# Altium project DRIVER MOTION_A.PrjPcb (part 1 of 2)
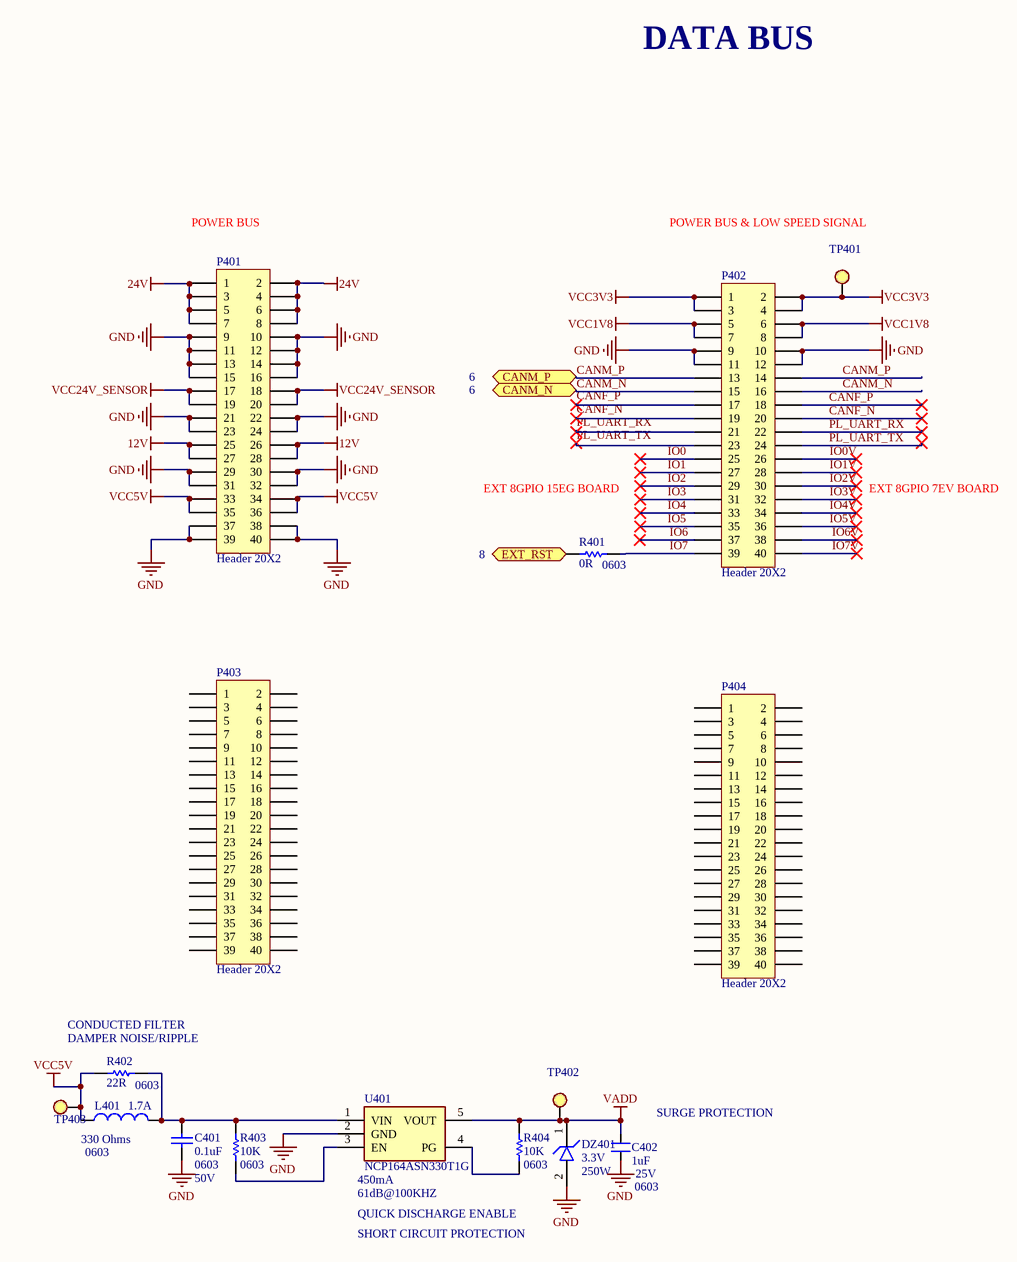
[diagram p0: [4]_MOT_POWER.SchDoc]
9 sheets, 302 parts. Net scope: flat (ports and power ports of the same name join across sheets).
Board file: DRIVER MOTION PAN.PcbDoc
Sheets:
  [4]_MOT_POWER.SchDoc
  [5]_MOT_MCU MKV58.SchDoc
  [6]_MOT_H-BDIGDE FOC.SchDoc
  [7]_MOT_CONTROL LED STATUS.SchDoc
  [8]_MOT_CONNECTOR.SchDoc
  [9]_MOT_tMCU MKV58.SchDoc
  [10]_MOT_tH-BDIGDE FOC.SchDoc
  [11]_MOT_tCONTROL LED STATUS.SchDoc
  [12]_MOT_tCONNECTOR.SchDoc

## Sheet [4]_MOT_POWER.SchDoc
size A3; DocumentNumber: 4; SheetNumber: 4; SheetTotal: 12; Ngu?i ki?m tra: bangdd; Ngu?i thi?t k?: thannt114

### Parts
C401  FOOTPRINT: 0603  Voltage: 50V  [CAP 0603]  (hidden comment: 0.1uF)
C402  PCB FOOTPRINT: 0603  Voltage: 25V  [CAP 0603]  (hidden comment: 1uF)
DZ401  Voltage - Reverse Standoff: 3.3V  Power - Peak Pulse: 250W  [SOD-323]  (hidden comment: ESD8351HT1G)
L401  PCB Footprint: 0603  Current: 1.7A  [FB 0603]  (hidden comment: 330 Ohms)
P401  Header 20X2  [SAMTEC_SSQ-120-03-G-D]
P402  Header 20X2  [SAMTEC_SSQ-120-03-G-D]
P403  Header 20X2  [SAMTEC_SSQ-120-03-G-D]
P404  Header 20X2  [SAMTEC_SSQ-120-03-G-D]
R401  PCB Footprint: 0603  [res 0603]  (hidden comment: 0R)  (no BOM)
R402  PCB Footprint: 0603  [res 0603]  (hidden comment: 22R)
R403  PCB Footprint: 0603  [res 0603]  (hidden comment: 10K)
R404  PCB Footprint: 0603  [res 0603]  (hidden comment: 10K)
TP401  TP SMD  [TESTPOINT]  (value not drawn)  (no BOM)
TP402  TP SMD  [TESTPOINT]  (value not drawn)  (no BOM)
TP403  TP SMD  [TESTPOINT]  (value not drawn)  (no BOM)
U401  NCP164ASN330T1G  CURRENT: 450mA  PSRR: 61dB@100KHZ  [SOT23-5]

### Ports
CANM_N (bidir, see 6), CANM_P (bidir, see 6), EXT_RST (bidir, see 8)

### Nets
12V: P401.25 P401.26 P401.27 P401.28
24V: P401.1 P401.2 P401.3 P401.4 P401.5 P401.6 P401.7 P401.8
GND: C401.1 C402.2 DZ401.2 P401.9 P401.10 P401.11 P401.12 P401.13 P401.14 P401.15 P401.16 P401.21 P401.22 P401.23 P401.24 P401.29 P401.30 P401.31 P401.32 P401.37 P401.38 P401.39 P401.40 P402.9 P402.10 P402.11 P402.12 U401.2(GND)
VADD: C402.1 DZ401.1 R404.1 TP402.1 U401.5(VOUT)
VCC1V8: P402.5 P402.6 P402.7 P402.8
VCC3V3: P402.1 P402.2 P402.3 P402.4 TP401.1
VCC5V: L401.1 P401.33 P401.34 P401.35 P401.36 R402.1 TP403.1
VCC24V_SENSOR: P401.17 P401.18 P401.19 P401.20
CANF_N: P402.19 P402.20
CANF_P: P402.17 P402.18
CANM_N: P402.15 P402.16 ; port CANM_N
CANM_P: P402.13 P402.14 ; port CANM_P
IO0: P402.25
IO0V: P402.26
IO1: P402.27
IO1V: P402.28
IO2: P402.29
IO2V: P402.30
IO3: P402.31
IO3V: P402.32
IO4: P402.33
IO4V: P402.34
IO5: P402.35
IO5V: P402.36
IO6: P402.37
IO6V: P402.38
IO7: P402.39 R401.2
IO7V: P402.40
PL_UART_RX: P402.21 P402.22
PL_UART_TX: P402.23 P402.24
NetC401_2: C401.2 L401.2 R402.2 R403.1 U401.1(VIN)
NetR401_1: R401.1 ; port EXT_RST
NetR403_2: R403.2 U401.3(EN)
NetR404_2: R404.2 U401.4(PG)

Not connected (* = marked no-connect by the designer): P403 1 2 3 4 5 6 7 8 9 10 11 12 13 14 15 16 17 18 19 20 21 22 23 24 25 26 27 28 29 30 31 32 33 34 35 36 37 38 39 40; P404 1 2 3 4 5 6 7 8 9 10 11 12 13 14 15 16 17 18 19 20 21 22 23 24 25 26 27 28 29 30 31 32 33 34 35 36 37 38 39 40

### Notes on the sheet
- DATA BUS
- (near P401) POWER BUS
- POWER BUS & LOW SPEED SIGNAL
- EXT 8GPIO 15EG BOARD
- EXT 8GPIO 7EV BOARD
- (near R402) CONDUCTED FILTER
- (near R402) DAMPER NOISE/RIPPLE
- (near C402) SURGE PROTECTION
- QUICK DISCHARGE ENABLE
- SHORT CIRCUIT PROTECTION

### Library data of the parts
C401 = Cap: CAP-CER,SMD;0.1UF,10%,50V,X7R,0603; MANUFACTURER1: Samsung Electro-Mechanics; MANUFACTURER1_PART#: CL10B104KB8NNNC; MANUFACTURER2_PART#: M0603X104K050TAX; MANUFACTURER1: SS; Unit: PCS; PACKING: Tape & Reel (TR); Process Type: SM; CATEGORY: CAP-CER; VALUE: 0.1uF; Material: X7R; PCB FOOTPRINT: 0603; Tolerance: ±10%; MANUFACTURER2: UWA
C402 = Cap_1uF: CAP CER 1UF 25V X7R 0603; MANUFACTURER1: Samsung Electro-Mechanics; MANUFACTURER1_PART#: CL10A105KA8NNNC; MANUFACTURER2_PART#: TMK107B7105KA-T; PACKING: TR; UNIT: PCS; Material: X5R; Process Type: SM; Tolerance: 10%; Value: 1uF; CATEGORY: CAP CER; PCB_ Footprint: 0603; MANUFACTURER2: Taiyo Yuden; LOH_Code: *
DZ401 = TVS-DIODE;BI-DIR,600W,30V/48.4V,DO214AA,SMBJ30A-E3/52: TVS DIODE 3.3VWM 11.2VC SOD323; MANUFACTURER1: onsemi; Category: TVS; MANUFACTURER1_PART#: ESD8351HT1G; VALUE: ESD8351HT1G; LINK: https://www.digikey.com/en/products/detail/onsemi/ESD8351HT1G/5257577; PRICE: 0.16
L401 = inductor 2.2uF: FERRITE BEAD 330 OHM 0603 1LN; MANUFACTURER1: TDK Corporation; MANUFACTURER1_PART#: MPZ1608S331ATA00; MANUFACTURER2_PART#: BLM18KG331SN1D; PACKING: Tape & Reel (TR); Process Type: SM; Unit: PCS; Tolerance: ±10%; Category: Inductor; DESCRIPTION_: FERRITE BEAD 330 OHM 0603 1LN; MANUFACTURER2: Murata Electronics; Value: 330 Ohms
P401-P404 = Header 20X2: Header, 20-Pin, Dual row; LatestRevisionDate: 17-Jul-2002; LatestRevisionNote: Re-released for DXP Platform.; Publisher: Altium Limited
R401 = Res0.3: RES SMD 0 OHM JUMPER 1/10W 0603; MANUFACTURER1: Yageo; MANUFACTURER1_PART#: RC0603JR-070RL; MANUFACTURER2_PART#: RMCF0603ZT0R00; PACKING: Tape & Reel (TR); Process Type: SM; Unit: PCS; Power: 0.25W; Tolerance: 5%; Value: 0R; CATEGORY: RES SMD; MANUFACTURER2: Stackpole Electronics Inc
R402 = Res0.3: RES 22 OHM 5% 1/10W 0603; MANUFACTURER1: Yageo; MANUFACTURER1_PART#: RC0603JR-0722RL; MANUFACTURER2_PART#: RMCF0603JT22R0; PACKING: Tape & Reel (TR); Process Type: SM; Unit: PCS; Power: 0.25W; Value: 22R; CATEGORY: RES SMD; MANUFACTURER2: Stackpole Electronics Inc; Tolerance: 5%
R403 R404 = Res0.3: RES SMD,10K OHM 5% 1/10W 0603; MANUFACTURER1: Stackpole Electronics Inc; MANUFACTURER1_PART#: RMCF0603JT10K0; MANUFACTURER2_PART#: R0603J10KKDX; PACKING: Tape & Reel (TR); Process Type: SM; Unit: PCS; Power: 0.25W; Value: 10K; CATEGORY: RES-SMD; MANUFACTURER2: UWA; Tolerance: ±5%
TP401-TP403 = TP SMD: TEST POINT
U401 = MIC5504-3.3YM5-TR: LDO 300 MA AD 3.3V ULTRA-LOW NOISE SOT23-5; MANUFACTURER1: onsemi; PROCESS_TYPE: SM; MANUFACTURER1_PART#: NCP164ASN330T1G; Category: IC; VALUE: NCP164ASN330T1G

## Sheet [5]_MOT_MCU MKV58.SchDoc
size A3; DocumentNumber: 5; SheetNumber: 5; SheetTotal: 12; Ngu?i ki?m tra: bangdd; Ngu?i thi?t k?: thannt114
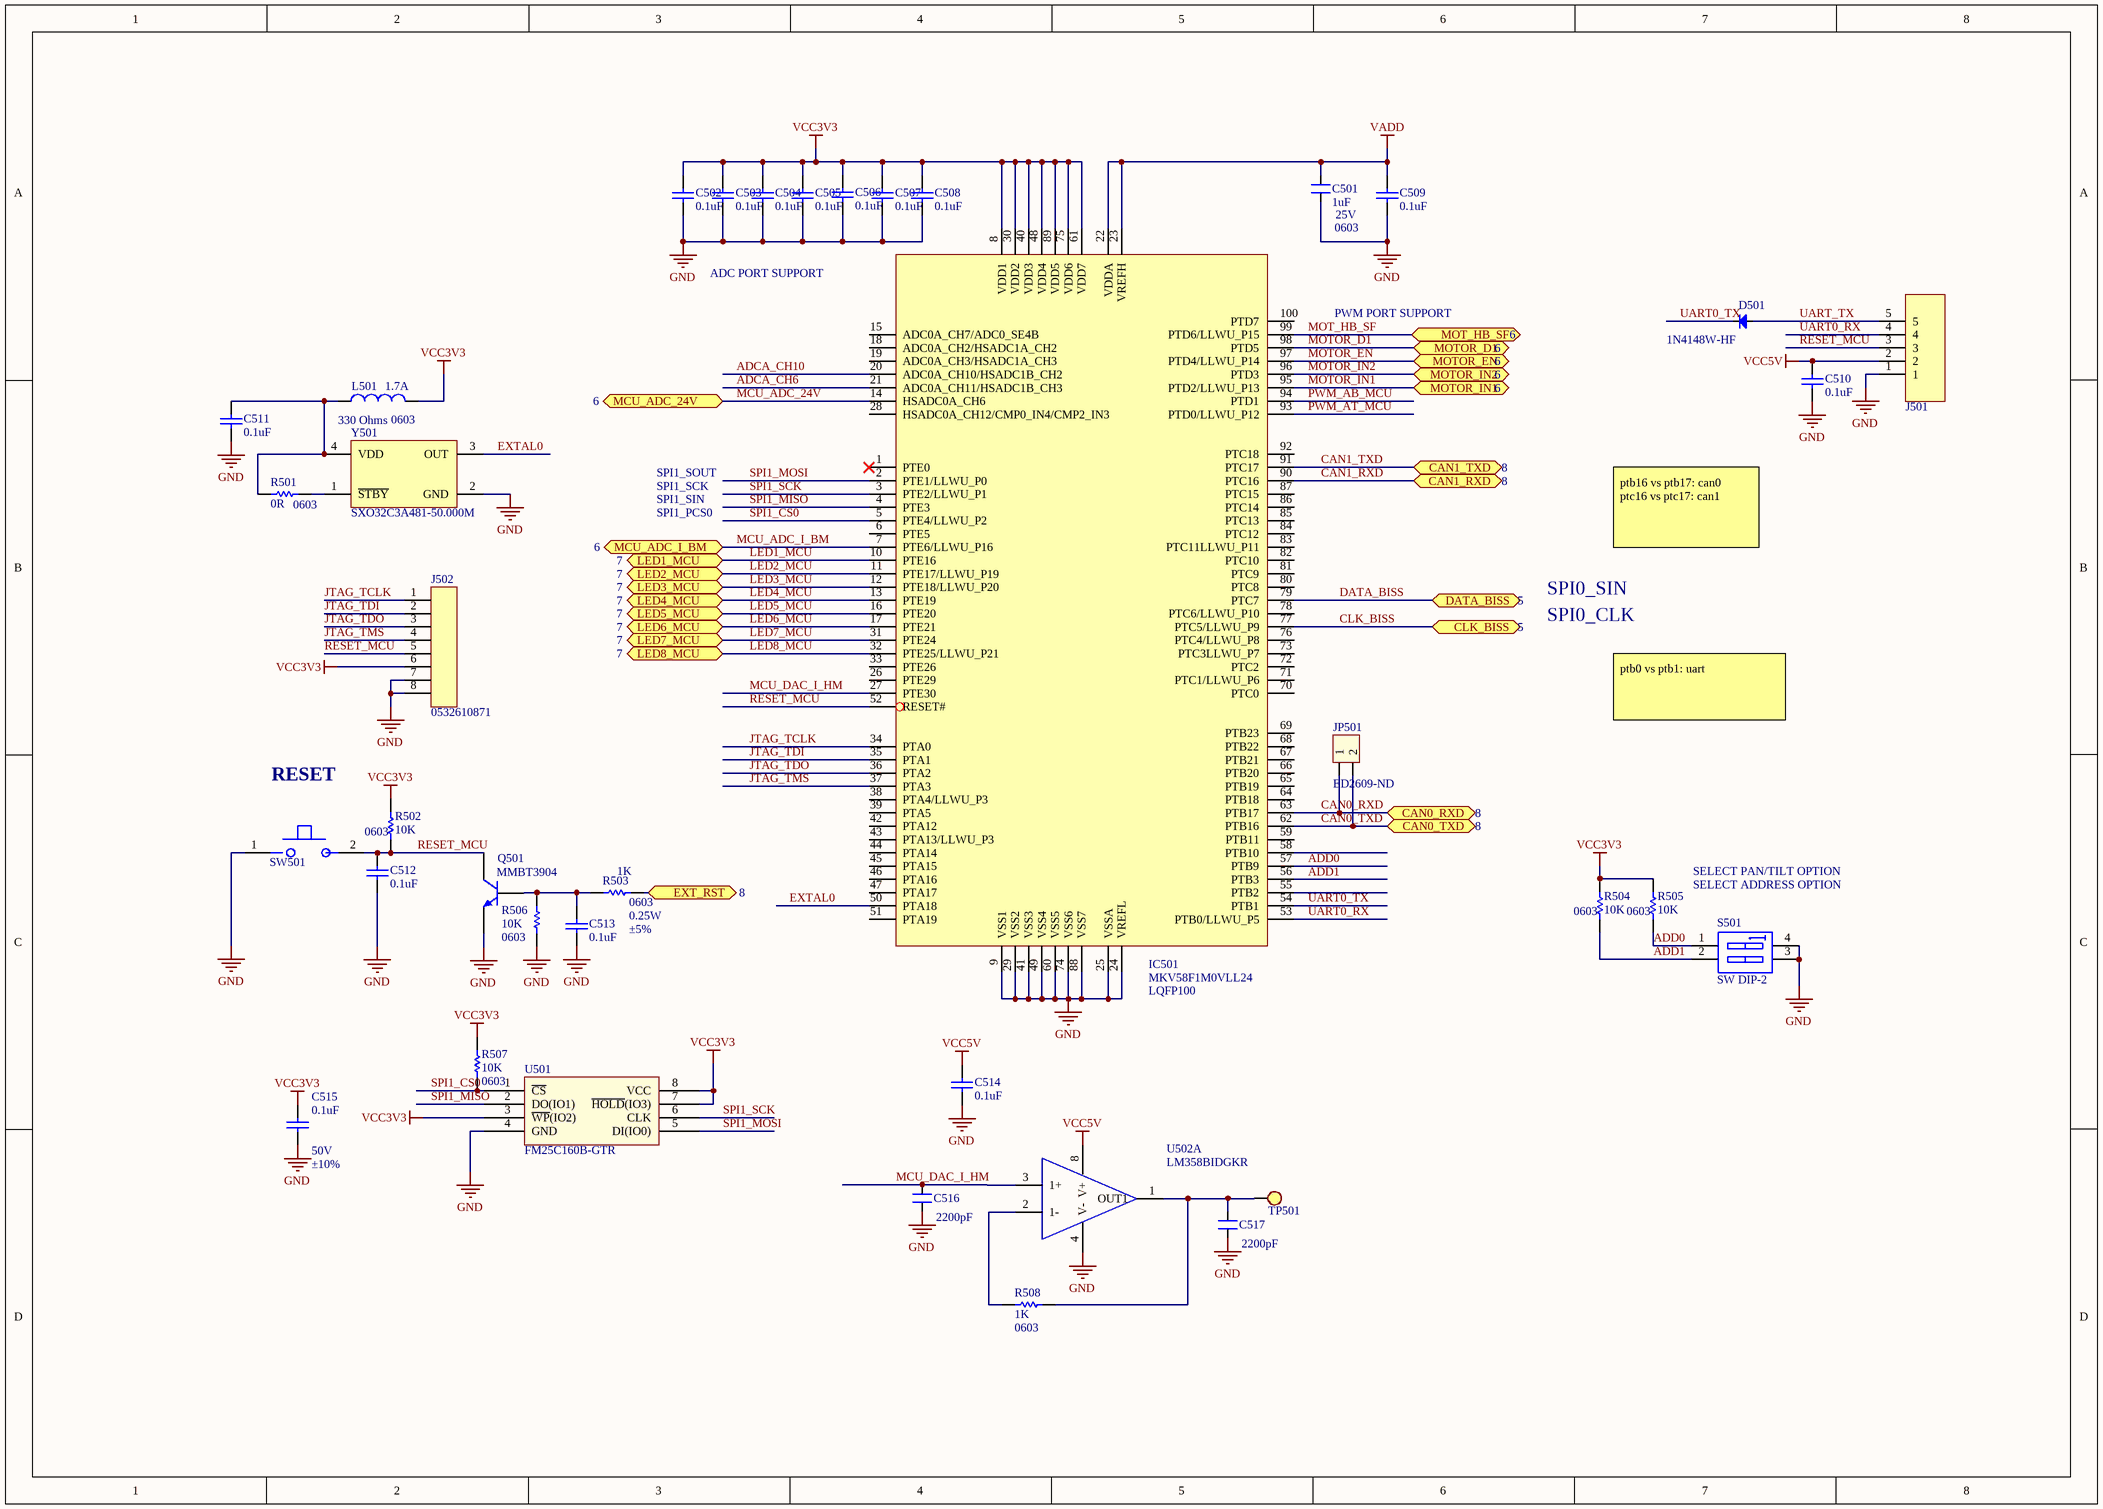
[diagram p1: [5]_MOT_MCU MKV58.SchDoc]

### Parts
C501  PCB FOOTPRINT: 0603  Voltage: 25V  [CAP 0603]  (hidden comment: 1uF)
C502  0.1uF  [CAP 0603]
C503  0.1uF  [CAP 0603]
C504  0.1uF  [CAP 0603]
C505  0.1uF  [CAP 0603]
C506  0.1uF  [CAP 0603]
C507  0.1uF  [CAP 0603]
C508  0.1uF  [CAP 0603]
C509  0.1uF  [CAP 0603]
C510  0.1uF  [CAP 0603]
C511  0.1uF  [CAP 0603]
C512  0.1uF  [CAP 0603]
C513  0.1uF  [CAP 0603]
C514  0.1uF  [CAP 0603]
C515  Voltage: 50V  Tolerance: ±10%  [CAP 0603]  (hidden comment: 0.1uF)
C516  2200pF  [CAP 0603]
C517  2200pF  [CAP 0603]
D501  1N4148W-HF  [DIO-SMD-123]
IC501  MANUFACTURER1_PART#: MKV58F1M0VLL24  PACKAGE: LQFP100  [100-LQFP]  (hidden comment: IC;IC MCU 32BIT 1MB FLASH 100LQFP,100-LQFP,-40TO 105°C,MKV58F1M0VLL24)
J501  HEADER;HEADER 5 POS 2.54MM  [HEADER 5 2.54MM]  (value not drawn)
J502  Manufacturer Part Number: 0532610871  [CONN-8]  (hidden comment: CONN-SMD;CONN HEADER SMD R/A,M,1Rx8Px1.25MM,0532610871)
JP501  ED2609-ND  [MF52A2103J3470]
L501  PCB Footprint: 0603  Current: 1.7A  [FB 0603]  (hidden comment: 330 Ohms)
Q501  MMBT3904  [SOT-23]
R501  PCB Footprint: 0603  [res 0603]  (hidden comment: 0R)  (no BOM)
R502  PCB Footprint: 0603  [res 0603]  (hidden comment: 10K)
R503  PCB Footprint: 0603  Power: 0.25W  Tolerance: ±5%  [res 0603]  (hidden comment: 1K)
R504  PCB Footprint: 0603  [res 0603]  (hidden comment: 10K)
R505  PCB Footprint: 0603  [res 0603]  (hidden comment: 10K)
R506  PCB Footprint: 0603  [res 0603]  (hidden comment: 10K)
R507  PCB Footprint: 0603  [res 0603]  (hidden comment: 10K)
R508  PCB Footprint: 0603  [res 0603]  (hidden comment: 1K)
S501  SW DIP-2  [219-2LPSTR]
SW501  SWITCH;TACTILE SWITCH SPST-NO TOP ACTUATED,2-SMD,MJTP1106STR  [SW]  (value not drawn)
TP501  TP SMD  [TESTPOINT]  (value not drawn)  (no BOM)
U501  FM25C160B-GTR  [SOIC-8 150MIL]
U502  LM358BIDGKR  [8-VSSOP]  (part A of 2)
Y501  SXO32C3A481-50.000M  [DFN210P320X85-4N]

### Ports
CAN0_RXD (bidir, see 8), CAN0_TXD (bidir, see 8), CAN1_RXD (bidir, see 8), CAN1_TXD (bidir, see 8), CLK_BISS (bidir, see 5), DATA_BISS (bidir, see 5), EXT_RST (bidir, see 8), LED1_MCU (bidir, see 7), LED2_MCU (bidir, see 7), LED3_MCU (bidir, see 7), LED4_MCU (bidir, see 7), LED5_MCU (bidir, see 7), LED6_MCU (bidir, see 7), LED7_MCU (bidir, see 7), LED8_MCU (bidir, see 7), MCU_ADC_24V (bidir, see 6), MCU_ADC_I_BM (bidir, see 6), MOT_HB_SF (bidir, see 6), MOTOR_D1 (bidir, see 6), MOTOR_EN (bidir, see 6), MOTOR_IN1 (bidir, see 6), MOTOR_IN2 (bidir, see 6)

### Nets
GND: C501.2 C502.2 C503.2 C504.2 C505.2 C506.2 C507.2 C508.2 C509.2 C510.2 C511.2 C512.2 C513.2 C514.1 C515.2 C516.2 C517.2 IC501.9(VSS1) IC501.24(VREFL) IC501.25(VSSA) IC501.29(VSS2) IC501.41(VSS3) IC501.49(VSS4) IC501.60(VSS5) IC501.74(VSS6) IC501.88(VSS7) J501.1 J502.7 J502.8 Q501.2(E) R506.2 S501.3(B2) S501.4(B1) SW501.1 U501.4(GND) U502.4(V-) Y501.2(GND)
VADD: C501.1 C509.1 IC501.22(VDDA) IC501.23(VREFH)
VCC3V3: C502.1 C503.1 C504.1 C505.1 C506.1 C507.1 C508.1 C515.1 IC501.8(VDD1) IC501.30(VDD2) IC501.40(VDD3) IC501.48(VDD4) IC501.61(VDD7) IC501.75(VDD6) IC501.89(VDD5) J502.6 L501.2 R502.1 R504.1 R505.1 R507.1 U501.3(~{WP}(IO2)) U501.7(~{HOLD}(IO3)) U501.8(VCC)
VCC5V: C510.1 C514.2 J501.2 U502.8(V+)
ADCA_CH6: IC501.21(ADC0A_CH11/HSADC1B_CH3)
ADCA_CH10: IC501.20(ADC0A_CH10/HSADC1B_CH2)
ADD0: IC501.57(PTB9) R505.2 S501.1(A1)
ADD1: IC501.56(PTB3) R504.2 S501.2(A2)
CAN0_RXD: IC501.63(PTB17) JP501.1 ; port CAN0_RXD
CAN0_TXD: IC501.62(PTB16) JP501.2 ; port CAN0_TXD
CAN1_RXD: IC501.90(PTC16) ; port CAN1_RXD
CAN1_TXD: IC501.91(PTC17) ; port CAN1_TXD
CLK_BISS: IC501.77(PTC5/LLWU_P9) ; port CLK_BISS
DATA_BISS: IC501.79(PTC7) ; port DATA_BISS
EXTAL0: IC501.50(PTA18) Y501.3(OUT)
JTAG_TCLK: IC501.34(PTA0) J502.1
JTAG_TDI: IC501.35(PTA1) J502.2
JTAG_TDO: IC501.36(PTA2) J502.3
JTAG_TMS: IC501.37(PTA3) J502.4
LED1_MCU: IC501.10(PTE16) ; port LED1_MCU
LED2_MCU: IC501.11(PTE17/LLWU_P19) ; port LED2_MCU
LED3_MCU: IC501.12(PTE18/LLWU_P20) ; port LED3_MCU
LED4_MCU: IC501.13(PTE19) ; port LED4_MCU
LED5_MCU: IC501.16(PTE20) ; port LED5_MCU
LED6_MCU: IC501.17(PTE21) ; port LED6_MCU
LED7_MCU: IC501.31(PTE24) ; port LED7_MCU
LED8_MCU: IC501.32(PTE25/LLWU_P21) ; port LED8_MCU
MCU_ADC_24V: IC501.14(HSADC0A_CH6) ; port MCU_ADC_24V
MCU_ADC_I_BM: IC501.7(PTE6/LLWU_P16) ; port MCU_ADC_I_BM
MCU_DAC_I_HM: C516.1 IC501.27(PTE30) U502.3(1+)
MOT_HB_SF: IC501.99(PTD6/LLWU_P15) ; port MOT_HB_SF
MOTOR_D1: IC501.98(PTD5) ; port MOTOR_D1
MOTOR_EN: IC501.97(PTD4/LLWU_P14) ; port MOTOR_EN
MOTOR_IN1: IC501.95(PTD2/LLWU_P13) ; port MOTOR_IN1
MOTOR_IN2: IC501.96(PTD3) ; port MOTOR_IN2
PWM_AB_MCU: IC501.94(PTD1)
PWM_AT_MCU: IC501.93(PTD0/LLWU_P12)
RESET_MCU: C512.1 IC501.52(RESET#) J501.3 J502.5 Q501.3(C) R502.2 SW501.2
SPI1_CS0: IC501.5(PTE4/LLWU_P2) R507.2 U501.1(~{CS})
SPI1_MISO: IC501.4(PTE3) U501.2(DO(IO1))
SPI1_MOSI: IC501.2(PTE1/LLWU_P0) U501.5(DI(IO0))
SPI1_SCK: IC501.3(PTE2/LLWU_P1) U501.6(CLK)
UART0_RX: IC501.53(PTB0/LLWU_P5) J501.4
UART0_TX: D501.2(K) IC501.54(PTB1)
UART_TX: D501.1(A) J501.5
NetC511_1: C511.1 L501.1 R501.1 Y501.4(VDD)
NetC513_1: C513.1 Q501.1(B) R503.2 R506.1
NetC517_1: C517.1 R508.2 TP501.1 U502.1(OUT1)
NetR401_1: R503.1 ; port EXT_RST
NetR501_2: R501.2 Y501.1(~{STBY})
NetR508_1: R508.1 U502.2(1-)

Not connected (* = marked no-connect by the designer): IC501 1(PTE0)* 6(PTE5) 15(ADC0A_CH7/ADC0_SE4B) 18(ADC0A_CH2/HSADC1A_CH2) 19(ADC0A_CH3/HSADC1A_CH3) 26(PTE29) 28(HSADC0A_CH12/CMP0_IN4/CMP2_IN3) 33(PTE26) 38(PTA4/LLWU_P3) 39(PTA5) 42(PTA12) 43(PTA13/LLWU_P3) 44(PTA14) 45(PTA15) 46(PTA16) 47(PTA17) 51(PTA19) 55(PTB2) 58(PTB10) 59(PTB11) 64(PTB18) 65(PTB19) 66(PTB20) 67(PTB21) 68(PTB22) 69(PTB23) 70(PTC0) 71(PTC1/LLWU_P6) 72(PTC2) 73(PTC3LLWU_P7) 76(PTC4/LLWU_P8) 78(PTC6/LLWU_P10) 80(PTC8) 81(PTC9) 82(PTC10) 83(PTC11LLWU_P11) 84(PTC12) 85(PTC13) 86(PTC14) 87(PTC15) 92(PTC18) 100(PTD7)

### Notes on the sheet
- ADC PORT SUPPORT
- PWM PORT SUPPORT
- SPI1_SOUT
- SPI1_SCK
- SPI1_SIN
- SPI1_PCS0
- ptb16 vs ptb17: can0
  ptc16 vs ptc17: can1
- SPI0_SIN
- SPI0_CLK
- ptb0 vs ptb1: uart
- RESET
- SELECT PAN/TILT OPTION
- SELECT ADDRESS OPTION

### Library data of the parts
C501 = Cap_1uF: as C402 on sheet [4]_MOT_POWER; Value: 1uF; CATEGORY: CAP CER; PCB_ Footprint: 0603; MANUFACTURER2: Taiyo Yuden; LOH_Code: *
C502-C514 = Cap: CAP-CER,SMD;0.1UF,10%,50V,X7R,0603; MANUFACTURER1: Samsung Electro-Mechanics; MANUFACTURER1_PART#: CL10B104KB8NNNC; MANUFACTURER2_PART#: M0603X104K050TAX; MANUFACTURER1: SS; Unit: PCS; PACKING: Tape & Reel (TR); PCB FOOTPRINT: 0603; Process Type: SM; CATEGORY: CAP-CER; VALUE: 0.1uF; FOOTPRINT: 0603; Material: X7R; Voltage: 50V; Tolerance: ±10%; MANUFACTURER2: UWA
C515 = Cap: CAP-CER,SMD;0.1UF,10%,50V,X7R,0603; MANUFACTURER1: Samsung Electro-Mechanics; MANUFACTURER1_PART#: CL10B104KB8NNNC; MANUFACTURER2_PART#: M0603X104K050TAX; MANUFACTURER1: SS; Unit: PCS; PACKING: Tape & Reel (TR); PCB FOOTPRINT: 0603; Process Type: SM; LOH_Code: 101100038; CATEGORY: CAP-CER; VALUE: 0.1uF; FOOTPRINT: 0603; Material: X7R; MANUFACTURER2: UWA
C516 C517 = CN: CAP CER 2200PF 50V X7R 0603; MANUFACTURER1: Samsung Electro-Mechanics; MANUFACTURER1_PART#: CL10B222KB8NFNC; PACKING: TR; PCB FOOTPRINT: 0603; PROCESS_TYPE: SMT; Tolerance: ±10%; Value: 2200pF; CATEGORY: CAP CER; Voltage - Rated: 50V; Temperature Coefficient: X7R
D501 = Diode SMD: Default Diode; MANUFACTURER1: Comchip; VOLTAGE: 75V; CURRENT: 150mA; MANUFACTURER1_PART#: 1N4148W-HF; Value: 1N4148W-HF
IC501 = IC;IC MCU 32BIT 1MB FLASH 100LQFP,100-LQFP,-40TO 105°C,MKV58F1M0VLL24: IC MCU 32BIT 1MB FLASH 100LQFP; Manufacturer: NXP USA Inc.; Manufacturer Part Number: MKV58F1M0VLL24; Category: IC; MANUFACTURER1: NXP USA Inc.
J501 = HEADER;HEADER 5 POS 2.54MM: HEADER 5 POS 2.54MM; MANUFACTURER1: LKCL; MANUFACTURER1_PART#: XH2.54-5P
J502 = CONN-SMD;CONN HEADER SMD R/A,M,1Rx8Px1.25MM,0532610871: CONN HEADER SMD R/A 8POS 1.25MM; MANUFACTURER1: Molex; Category: CONN; MANUFACTURER1_PART#: 0532610871
JP501 = Con2: 2 Position Wire to Board Terminal Block Horizontal with Board 0.200" (5.08mm) Through Hole; Value: Connector 2; Digikey: ED2609-ND
L501 = inductor 2.2uF: as L401 on sheet [4]_MOT_POWER; Category: Inductor; DESCRIPTION_: FERRITE BEAD 330 OHM 0603 1LN; MANUFACTURER2: Murata Electronics; Value: 330 Ohms
Q501 = NPN: NPN 200mA 40V 350mW SOT-23 Transistors; MANUFACTURER1: Guangdong Hottech; PROCESS_TYPE: SM; PACKAGE: SOT23; Category: TRANSISTOR; MANUFACTURER2: HT(Shenzhen Jinyu Semicon); MANUFACTURER2_PART#: MMBT3904; MANUFACTURER1_PART#: MMBT3904; Value: MMBT3904
R501 = Res0.3: as R401 on sheet [4]_MOT_POWER; Value: 0R; CATEGORY: RES SMD; MANUFACTURER2: Stackpole Electronics Inc
R502 R504-R507 = Res0.3: as R403 on sheet [4]_MOT_POWER; Value: 10K; CATEGORY: RES-SMD; MANUFACTURER2: UWA; Tolerance: ±5%
R503 = Res0.3: RES SMD,1K OHM,5%,1/10W,0603; MANUFACTURER1: Stackpole Electronics Inc; MANUFACTURER1_PART#: RMCF06031K00JNEAC; MANUFACTURER2_PART#: R0603J1KTG; DESCCRIPTION: RES SMD 1K OHM 5% 1/10W 0603; PACKING: Tape & Reel (TR); Process Type: SM; Unit: PCS; LOH_Code: 140100083; Value: 1K; CATEGORY: RES SMD; MANUFACTURER2: UWA
R508 = Res0.3: RES SMD,1K OHM,5%,1/10W,0603; MANUFACTURER1: Stackpole Electronics Inc; MANUFACTURER1_PART#: RMCF06031K00JNEAC; MANUFACTURER2_PART#: R0603J1KTG; DESCCRIPTION: RES SMD 1K OHM 5% 1/10W 0603; PACKING: Tape & Reel (TR); Process Type: SM; Unit: PCS; LOH_Code: 140100083; Power: 0.25W; Value: 1K; CATEGORY: RES SMD; MANUFACTURER2: UWA; Tolerance: ±5%
S501 = SW DIP-2: DIP SWITCH, SPST, 2.54 PITCH, F; MANUFACTURER1_PART#: DS04-254-2-02BK-SMT; MANUFACTURER1: CUI; PRICE: 0.48800; CATEGORY: SWITCH; LINK: https://www.digikey.com/en/products/detail/cui-devices/DS04-254-2-02BK-SMT/11310860
SW501 = SWITCH;TACTILE SWITCH SPST-NO TOP ACTUATED,2-SMD,MJTP1106STR: SWITCH TACTILE SPST-NO 0.05A 12V; MANUFACTURER1: APEM Inc.; Manufacturer Part Number: MJTP1106STR; Category: BUTTON; MANUFACTURER1_PART#: MJTP1106STR
TP501 = TP SMD: TEST POINT
U501 = IC Flash W25Q16JVSNIQ QUAD SO8: IC FRAM 16KBIT SPI 20MHZ 8SOIC; MANUFACTURER1: Cypress; PACKING: Tape & Reel (TR); PCB Footprint: SO8; Process Type: SM; Unit: PCS; Voltage: 2.7V ~ 3.6V; Category: IC; MANUFACTURER1_PART#: FM25C160B-GTR; Value: FM25C160B-GTR
U502 = LM358BIDGKR: IC OPAMP GP 2 CIRCUIT 8VSSOP; Manufacturer Part Number: LM358BIDGKR
Y501 = OSCILLATOR;50MHZ,50ppm,3.2x2.5mm,ASEMB-50.000MHZ-LC-T: MEMS OSC XO 50.0000MHZ CMOS SMD; MANUFACTURER1: Suntsu; Manufacturer Part Number: SXO32C3A481-50.000M; MANUFACTURER1_PART#: SXO32C3A481-50.000M; VALUE: SXO32C3A481-50.000M

## Sheet [6]_MOT_H-BDIGDE FOC.SchDoc
size A3; DocumentNumber: 6; SheetNumber: 6; SheetTotal: 12; Ngu?i ki?m tra: bangdd; Ngu?i thi?t k?: thannt114
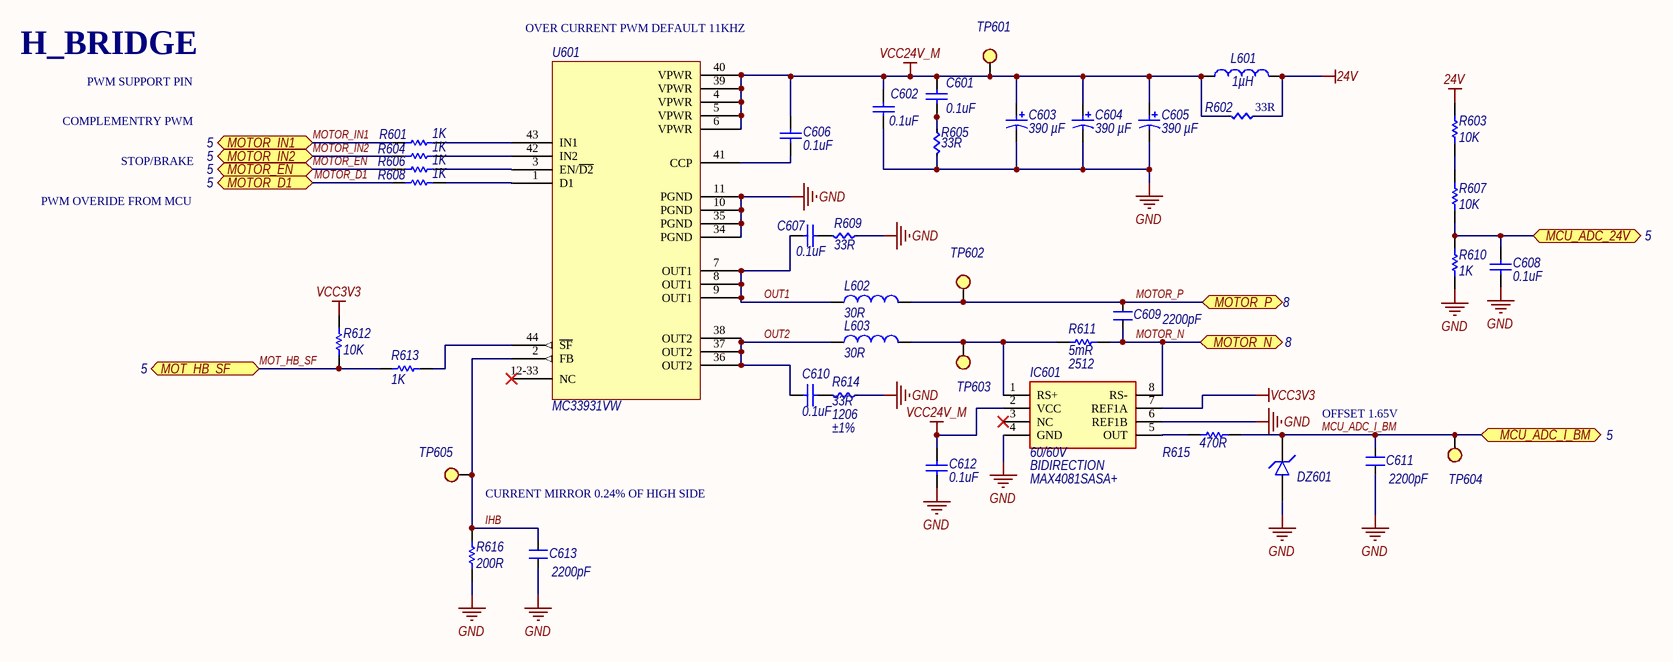
[diagram p2: [6]_MOT_H-BDIGDE FOC.SchDoc]

### Parts
C601  0.1uF  [CAP 0603]
C602  0.1uF  [CAP 0603]
C603  CPACITANCE: 390 µF  [MAL218397005E3]  (hidden comment: HTK-35V391MHC5E-R2)
C604  CPACITANCE: 390 µF  [MAL218397005E3]  (hidden comment: HTK-35V391MHC5E-R2)
C605  CPACITANCE: 390 µF  [MAL218397005E3]  (hidden comment: HTK-35V391MHC5E-R2)
C606  0.1uF  [CAP 0603]
C607  0.1uF  [CAP 0603]
C608  0.1uF  [CAP 0603]
C609  2200pF  [CAP 0603]
C610  0.1uF  [CAP 0603]
C611  2200pF  [CAP 0603]
C612  0.1uF  [CAP 0603]
C613  2200pF  [CAP 0603]
DZ601  ESD8351HT1G  [SOD-323]  (value not drawn)
IC601  GAIN: 60/60V  FUNCTION: BIDIRECTION  [8-SOIC]  (hidden comment: MAX4081SASA+)
L601  1µH  [IND 11.5x10x4mm]
L602  30R  [R0805]
L603  30R  [R0805]
R601  1K  [res 0603]
R602  33R  [RES 1206]
R603  10K  [res 0603]
R604  1K  [res 0603]
R605  33R  [RES 1206]
R606  1K  [res 0603]
R607  10K  [res 0603]
R608  1K  [res 0603]
R609  33R  [RES 1206]
R610  1K  [res 0603]
R611  value 5mR  PCB Footprint: 2512  [res 2512]  (hidden comment: CRF2512-FZ-R005ELF)
R612  10K  [res 0603]
R613  1K  [res 0603]
R614  33R  PACKAGE: 1206  Tolerance: ±1%  [RES 1206]
R615  470R  [res 0603]
R616  200R  [res 0603]
TP601  TP SMD  [TESTPOINT]  (value not drawn)  (no BOM)
TP602  TP SMD  [TESTPOINT]  (value not drawn)  (no BOM)
TP603  TP SMD  [TESTPOINT]  (value not drawn)  (no BOM)
TP604  TP SMD  [TESTPOINT]  (value not drawn)  (no BOM)
TP605  TP SMD  [TESTPOINT]  (value not drawn)  (no BOM)
U601  MC33931VW  [SOP44_FRE-M]

### Ports
MCU_ADC_24V (bidir, see 5), MCU_ADC_I_BM (bidir, see 5), MOT_HB_SF (bidir, see 5), MOTOR_D1 (bidir, see 5), MOTOR_EN (bidir, see 5), MOTOR_IN1 (bidir, see 5), MOTOR_IN2 (bidir, see 5), MOTOR_N (bidir, see 8), MOTOR_P (bidir, see 8)

### Nets
24V: L601.1 R602.1 R603.2
GND: C602.2 C603.2 C604.2 C605.2 C608.2 C611.2 C612.2 C613.2 DZ601.2 IC601.4(GND) IC601.6(REF1B) R605.2 R609.2 R610.2 R614.2 R616.1 U601.10(PGND) U601.11(PGND) U601.34(PGND) U601.35(PGND)
VCC3V3: IC601.7(REF1A) R612.1
VCC24V_M: C601.1 C602.1 C603.1 C604.1 C605.1 C606.1 C612.1 IC601.2(VCC) L601.2 R602.2 TP601.1 U601.4(VPWR) U601.5(VPWR) U601.6(VPWR) U601.39(VPWR) U601.40(VPWR)
IHB: C613.1 R616.2 TP605.1 U601.2(FB)
MCU_ADC_24V: C608.1 R607.1 R610.1 ; port MCU_ADC_24V
MCU_ADC_I_BM: C611.1 DZ601.1 R615.2 TP604.1 ; port MCU_ADC_I_BM
MOT_HB_SF: R612.2 R613.1 ; port MOT_HB_SF
MOTOR_D1: R608.1 ; port MOTOR_D1
MOTOR_EN: R606.1 ; port MOTOR_EN
MOTOR_IN1: R601.1 ; port MOTOR_IN1
MOTOR_IN2: R604.1 ; port MOTOR_IN2
MOTOR_N: C609.2 IC601.8(RS-) R611.2 ; port MOTOR_N
MOTOR_P: C609.1 L602.2 TP602.1 ; port MOTOR_P
OUT1: C607.1 L602.1 U601.7(OUT1) U601.8(OUT1) U601.9(OUT1)
OUT2: C610.1 L603.1 U601.36(OUT2) U601.37(OUT2) U601.38(OUT2)
NetC601_2: C601.2 R605.1
NetC606_2: C606.2 U601.41(CCP)
NetC607_2: C607.2 R609.1
NetC610_2: C610.2 R614.1
NetIC601_1: IC601.1(RS+) L603.2 R611.1 TP603.1
NetIC601_5: IC601.5(OUT) R615.1
NetR601_2: R601.2 U601.43(IN1)
NetR603_1: R603.1 R607.2
NetR604_2: R604.2 U601.42(IN2)
NetR606_2: R606.2 U601.3(EN/~{D2})
NetR608_2: R608.2 U601.1(D1)
NetR613_2: R613.2 U601.44(~{SF})

Not connected (* = marked no-connect by the designer): IC601 3(NC)*; U601 12-33(NC)*

### Notes on the sheet
- H_BRIDGE
- (near U601) OVER CURRENT PWM DEFAULT 11KHZ
- COMPLEMENTRY PWM
- PWM SUPPORT PIN
- PWM OVERIDE FROM MCU
- STOP/BRAKE
- OFFSET 1.65V
- CURRENT MIRROR 0.24% OF HIGH SIDE

### Library data of the parts
C601 C602 C606-C608 C610 C612 = Cap: as C502 on sheet [5]_MOT_MCU MKV58; CATEGORY: CAP-CER; VALUE: 0.1uF; FOOTPRINT: 0603; Material: X7R; Voltage: 50V; Tolerance: ±10%; MANUFACTURER2: UWA
C603-C605 = CAP-ALUM,SMD;470uF,20%,12.5x30,63V,287mOhm: HYBRID ECAP, 35V, 390UF, 30G VIB; MANUFACTURER1: Elna America; VOLTAGE: 63V; ESR: 18mOhm; Lifetime @ Temp.: 6000 Hrs @ 125°C; RIPPLE CURRENT: 3 A @ 100 kHz; Manufacturer Part Number: MAL218397005E3; Category: CAP-POLY-SMD; MANUFACTURER1_PART#: HTK-35V391MHC5E-R2; VALUE: HTK-35V391MHC5E-R2; LINK: https://www.digikey.com/en/products/detail/elna-america/HTK-35V391MHC5E-R2/10129270; PRICE: 1.732
C609 C611 C613 = CN: as C516 on sheet [5]_MOT_MCU MKV58; Value: 2200pF; CATEGORY: CAP CER; Voltage - Rated: 50V; Temperature Coefficient: X7R
DZ601 = TVS-DIODE;BI-DIR,600W,30V/48.4V,DO214AA,SMBJ30A-E3/52: TVS DIODE 3.3VWM 11.2VC SOD323; MANUFACTURER1: onsemi; Voltage - Reverse Standoff: 3.3V; Power - Peak Pulse: 250W; Category: TVS; MANUFACTURER1_PART#: ESD8351HT1G; VALUE: ESD8351HT1G; LINK: https://www.digikey.com/en/products/detail/onsemi/ESD8351HT1G/5257577; PRICE: 0.16
IC601 = IC; IC CURR SENSE 1 CIRCUIT,8-SOIC,-40TO 125°C,LT1999HMS8-20#PBF: IC CURR SENSE 1 CIRCUIT 8SOIC; MANUFACTURER1: Maxim; Manufacturer Part Number: MAX4081SASA+; PRICE: 3.05000; MANUFACTURER1_PART#: MAX4081SASA+; LINK: https://www.digikey.com/en/products/detail/maxim-integrated/MAX4080SASA-T/1703910; Category: IC; NI_MARK: *; VALUE: MAX4081SASA+; MANUFACTURER2: *; MANUFACTURER2_PART#: *
L601 = inductor 2.2uF: FIXED IND 1UH 17.5A 4.1 MOHM SMD; MANUFACTURER1: Mag Layers; MANUFACTURER1_PART#: MMD-10DZ-1R0M-V1-RU; PACKING: Tape & Reel (TR); PCB Footprint: (11.50mm x 10.00mm); Process Type: SM; Unit: PCS; Tolerance: ±20%; SAT CURENT: 5.6A; Category: Inductor; RATE Current: 17.5A; Value: 1µH; PRICE: 0.78000; LINK: https://www.digikey.com/en/products/detail/mag-layers/MMD-10DZ-1R0M-V1-RU/12182209
L602 L603 = inductor 2.2uF: FIXED IND 6.8UH 2.3A 52 MOHM SMD; MANUFACTURER1: Murata; MANUFACTURER1_PART#: BLM21SN300SH1D; PACKING: Tape & Reel (TR); PCB Footprint: 0805; Process Type: SM; Unit: PCS; Current: 6A; Tolerance: ±20%; CORE TYPE: FERRITE; Category: Inductor; Value: 30R
R601 R604 R606 R608 R610 R613 = Res0.3: RES SMD,1K OHM,5%,1/10W,0603; MANUFACTURER1: Stackpole Electronics Inc; MANUFACTURER1_PART#: RMCF06031K00JNEAC; MANUFACTURER2_PART#: R0603J1KTG; DESCCRIPTION: RES SMD 1K OHM 5% 1/10W 0603; PACKING: Tape & Reel (TR); PCB Footprint: 0603; Process Type: SM; Unit: PCS; LOH_Code: 140100083; Power: 0.25W; Value: 1K; CATEGORY: RES SMD; MANUFACTURER2: UWA; Tolerance: ±5%
R602 R605 R609 R614 = RES 510R 1206 5%: RES 33 OHM 1% 1/4W 1206; MANUFACTURER1: Stackpole; MANUFACTURER1_PART#: RMCF1206FT33R0; PROCESS_TYPE: SMT; Power (Watts): 1/2W; Packaging: Tape and Reel; CATEGORY: RES; VALUE: 33R
  R602 R605 R609: PACKAGE: 1206; Tolerance: ±1%
R603 R607 R612 = Res0.3: RES SMD,10K OHM 5% 1/10W 0603; MANUFACTURER1: Stackpole Electronics Inc; MANUFACTURER1_PART#: RMCF0603JT10K0; MANUFACTURER2_PART#: R0603J10KKDX; PACKING: Tape & Reel (TR); PCB Footprint: 0603; Process Type: SM; Unit: PCS; Power: 0.25W; Value: 10K; CATEGORY: RES-SMD; MANUFACTURER2: UWA; Tolerance: ±5%
R611 = Res0.3: RES 0.005 OHM 1% 2W 2512; MANUFACTURER1: Bourns; PACKING: Tape & Reel (TR); Process Type: SM; Unit: PCS; CATEGORY: RES SMD; MANUFACTURER1_PART#: CRF2512-FZ-R005ELF
R615 = Res0.3: RES SMD, 470 OHM 5% 1/8W 0603; MANUFACTURER1: KOA Speer Electronics, Inc.; MANUFACTURER1_PART#: RK73B1JTTD471J; MANUFACTURER2_PART#: RMCF0603JT470R; PACKING: Tape & Reel (TR); PCB Footprint: 0603; Process Type: SM; Unit: PCS; Power: 0.25W; Value: 470R; CATEGORY: RES SMD; MANUFACTURER2: Stackpole; Tolerance: ±5%
R616 = Res0.3: RES 200 OHM 1% 1/8W 0603; MANUFACTURER1: Stackpole Electronics Inc; MANUFACTURER1_PART#: RNCP0603FTD200R; MANUFACTURER2_PART#: RC0603FR-07200RL; DESCCRIPTION: RES SMD 1K OHM 5% 1/10W 0603; PACKING: Tape & Reel (TR); PCB Footprint: 0603; Process Type: SM; Unit: PCS; Power: 0.25W; Value: 200R; CATEGORY: RES SMD; MANUFACTURER2: YAGEO; Tolerance: ±1%
TP601-TP605 = TP SMD: TEST POINT
U601 = MC33931VW IC MOTOR DRIVER 5V-28V 44HSOP: IC MOTOR DRIVER 5V-28V 44HSOP; MANUFACTURER1: NXP; CURRENT: 5A; MAX INPUT: 28V; THERMAL RESISTANCE: 1*C/W; LOH_CODE: *; MANUFACTURER1_PART#: MC33931VW; Value: MC33931VW; PRICE: 13.54000; LINK: https://www.digikey.com/en/products/detail/nxp-usa-inc/MC33931VW/2185657

## Sheet [7]_MOT_CONTROL LED STATUS.SchDoc
size A3; DocumentNumber: 7; SheetNumber: 7; SheetTotal: 12
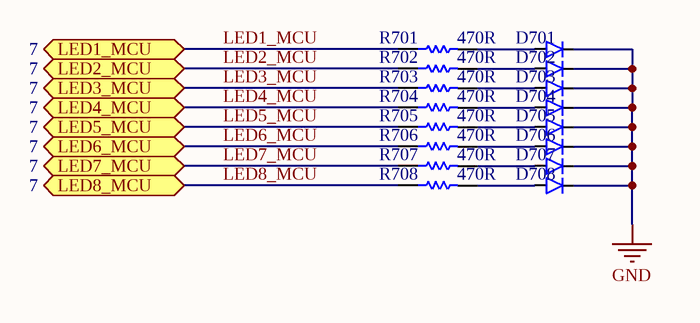
[diagram p3: [7]_MOT_CONTROL LED STATUS.SchDoc]

### Parts
D701  LED 0603  [LED0603]  (value not drawn)
D702  LED 0603  [LED0603]  (value not drawn)
D703  LED 0603  [LED0603]  (value not drawn)
D704  LED 0603  [LED0603]  (value not drawn)
D705  LED 0603  [LED0603]  (value not drawn)
D706  LED 0603  [LED0603]  (value not drawn)
D707  LED 0603  [LED0603]  (value not drawn)
D708  LED 0603  [LED0603]  (value not drawn)
R701  470R  [res 0603]
R702  470R  [res 0603]
R703  470R  [res 0603]
R704  470R  [res 0603]
R705  470R  [res 0603]
R706  470R  [res 0603]
R707  470R  [res 0603]
R708  470R  [res 0603]

### Ports
LED1_MCU (bidir, see 7), LED2_MCU (bidir, see 7), LED3_MCU (bidir, see 7), LED4_MCU (bidir, see 7), LED5_MCU (bidir, see 7), LED6_MCU (bidir, see 7), LED7_MCU (bidir, see 7), LED8_MCU (bidir, see 7)

### Nets
GND: D701.1(K) D702.1(K) D703.1(K) D704.1(K) D705.1(K) D706.1(K) D707.1(K) D708.1(K)
LED1_MCU: R701.1 ; port LED1_MCU
LED2_MCU: R702.1 ; port LED2_MCU
LED3_MCU: R703.1 ; port LED3_MCU
LED4_MCU: R704.1 ; port LED4_MCU
LED5_MCU: R705.1 ; port LED5_MCU
LED6_MCU: R706.1 ; port LED6_MCU
LED7_MCU: R707.1 ; port LED7_MCU
LED8_MCU: R708.1 ; port LED8_MCU
NetD701_2: D701.2(A) R701.2
NetD702_2: D702.2(A) R702.2
NetD703_2: D703.2(A) R703.2
NetD704_2: D704.2(A) R704.2
NetD705_2: D705.2(A) R705.2
NetD706_2: D706.2(A) R706.2
NetD707_2: D707.2(A) R707.2
NetD708_2: D708.2(A) R708.2

### Library data of the parts
R701-R708 = Res0.3: as R615 on sheet [6]_MOT_H-BDIGDE FOC; Value: 470R; CATEGORY: RES SMD; MANUFACTURER2: Stackpole; Tolerance: ±5%

## Sheet [8]_MOT_CONNECTOR.SchDoc
size A3; DocumentNumber: 8; SheetNumber: 8; SheetTotal: 12; Ngu?i ki?m tra: bangdd; Ngu?i thi?t k?: thannt114
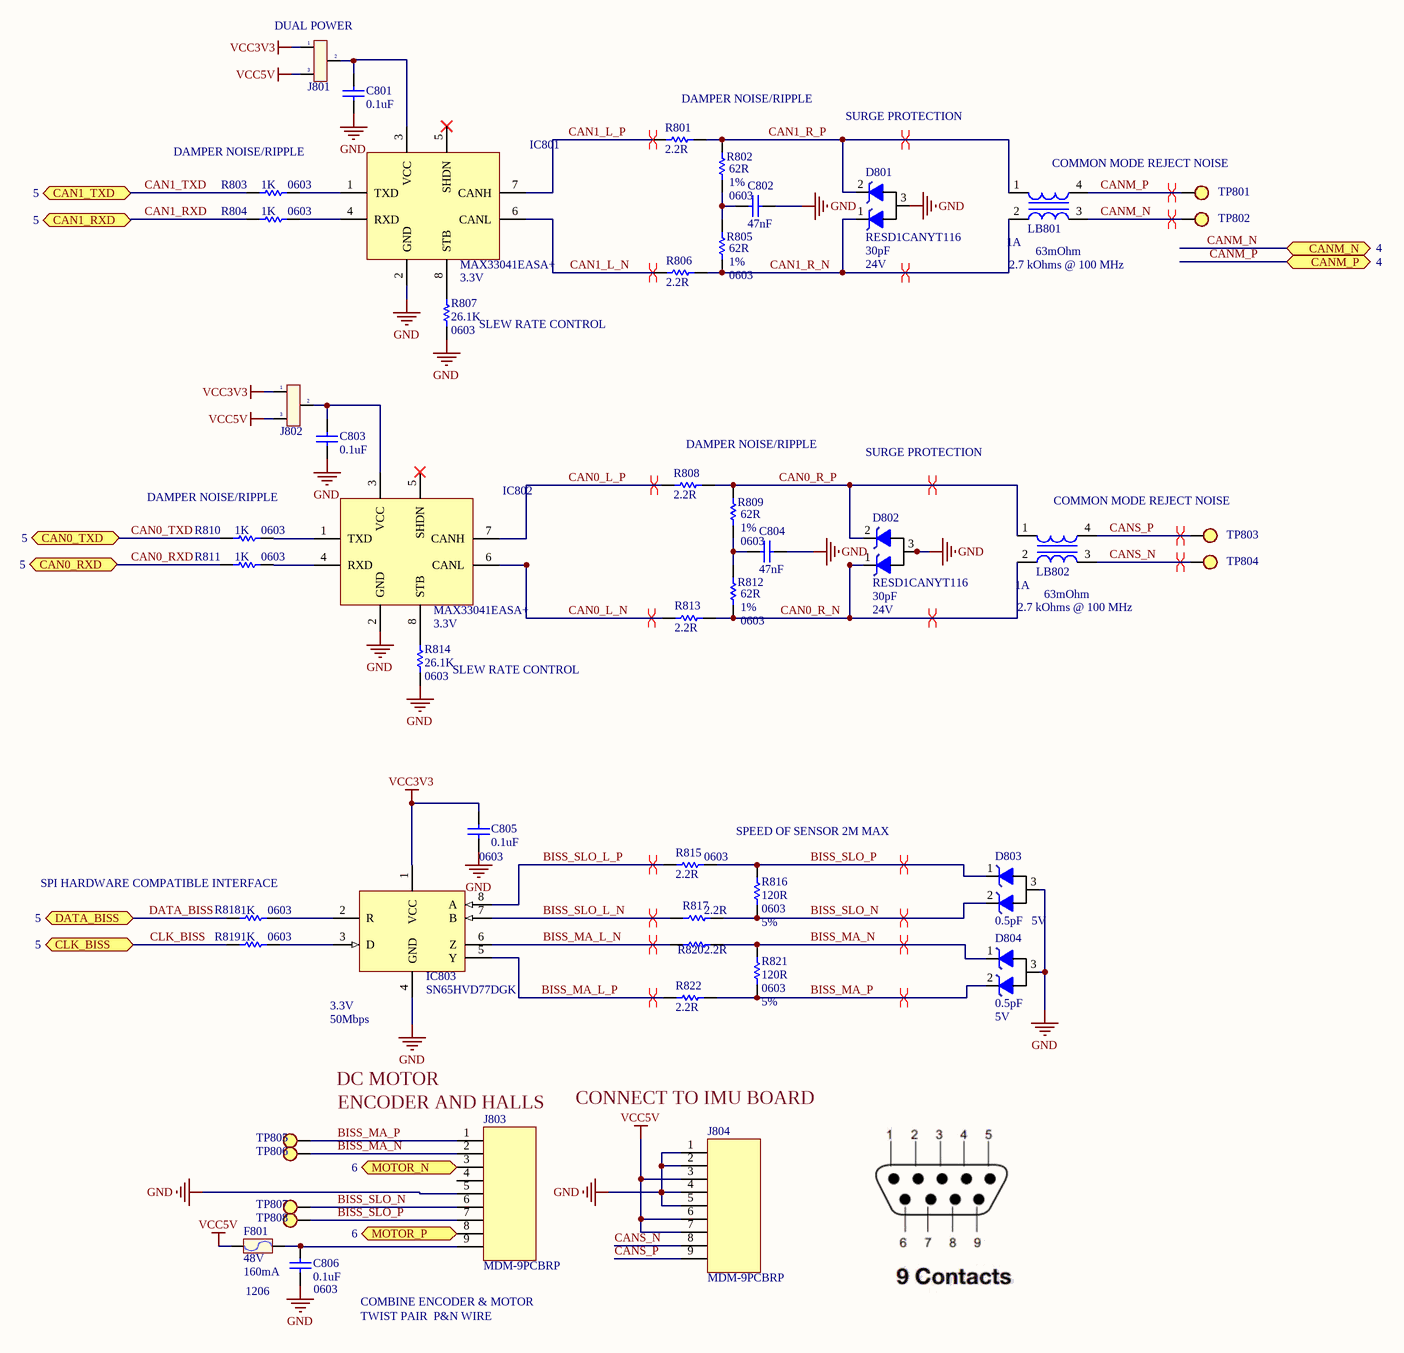
[diagram p4: [8]_MOT_CONNECTOR.SchDoc]

### Parts
C801  0.1uF  [CAP 0603]
C802  47nF  [CAP 0603]
C803  0.1uF  [CAP 0603]
C804  47nF  [CAP 0603]
C805  FOOTPRINT: 0603  [CAP 0603]  (hidden comment: 0.1uF)
C806  FOOTPRINT: 0603  [CAP 0603]  (hidden comment: 0.1uF)
D801  CAPACITANCE: 30pF  VOLTAGE: 24V  [SOT-23-3]  (hidden comment: RESD1CANYT116)
D802  CAPACITANCE: 30pF  VOLTAGE: 24V  [SOT-23-3]  (hidden comment: RESD1CANYT116)
D803  CAPACITANCE: 0.5pF  VOLTAGE: 5V  [SOT-416]  (hidden comment: ESDR0502BT1G)
D804  CAPACITANCE: 0.5pF  VOLTAGE: 5V  [SOT-416]  (hidden comment: ESDR0502BT1G)
F801  Voltage - Rated: 48V  Package / Case: 1206  Current Rating (Amps): 160mA  [RES 1206]  (hidden comment: 0ZCG0014FF2C)
IC801  VOLTAGE: 3.3V  [8-SOIC]  (hidden comment: MAX33041EASA+)
IC802  VOLTAGE: 3.3V  [8-SOIC]  (hidden comment: MAX33041EASA+)
IC803  Manufacturer Part Number: SN65HVD77DGK  VOLTAGE: 3.3V  SPEED: 50Mbps  [8-VSSOP]  (hidden comment: IC;IC TRANSCEIVER FULL 1/1 8SOIC,8-SOIC,-40TO 85°C,SN65HVD77DR)
J801  JP 2-1  [JP3]  (value not drawn)
J802  JP 2-1  [JP3]  (value not drawn)
J803  CONN-DIP;CONN MICRO-D PLUG 9POS R/A SLDR,M,MDM-9PCBRP  [MDM-9PCBRP]  (value not drawn)
J804  CONN-DIP;CONN MICRO-D PLUG 9POS R/A SLDR,M,MDM-9PCBRP  [MDM-9PCBRP]  (value not drawn)
LB801  CURRENT: 1A  IMPEDANCE: 2.7 kOhms @ 100 MHz  DCR: 63mOhm  [MCM-7060M]  (hidden comment: MCM-7060M-272-RU)
LB802  CURRENT: 1A  IMPEDANCE: 2.7 kOhms @ 100 MHz  DCR: 63mOhm  [MCM-7060M]  (hidden comment: MCM-7060M-272-RU)
R801  2.2R  [res 0603]
R802  TOLERANCE: 1%  PACKAGE: 0603  [R0603]  (hidden comment: 62R)
R803  PCB Footprint: 0603  [res 0603]  (hidden comment: 1K)
R804  PCB Footprint: 0603  [res 0603]  (hidden comment: 1K)
R805  TOLERANCE: 1%  PACKAGE: 0603  [R0603]  (hidden comment: 62R)
R806  2.2R  [res 0603]
R807  PCB Footprint: 0603  [R0603]  (hidden comment: 26.1K)
R808  2.2R  [res 0603]
R809  TOLERANCE: 1%  PACKAGE: 0603  [R0603]  (hidden comment: 62R)
R810  PCB Footprint: 0603  [res 0603]  (hidden comment: 1K)
R811  PCB Footprint: 0603  [res 0603]  (hidden comment: 1K)
R812  TOLERANCE: 1%  PACKAGE: 0603  [R0603]  (hidden comment: 62R)
R813  2.2R  [res 0603]
R814  PCB Footprint: 0603  [R0603]  (hidden comment: 26.1K)
R815  PCB Footprint: 0603  [res 0603]  (hidden comment: 2.2R)
R816  PCB_ Footprint: 0603  Tolerance: 5%  [res 0603]  (hidden comment: 120R)
R817  2.2R  [res 0603]
R818  PCB Footprint: 0603  [res 0603]  (hidden comment: 1K)
R819  PCB Footprint: 0603  [res 0603]  (hidden comment: 1K)
R820  2.2R  [res 0603]
R821  PCB_ Footprint: 0603  Tolerance: 5%  [res 0603]  (hidden comment: 120R)
R822  2.2R  [res 0603]
TP801  TP SMD  [TESTPOINT]  (value not drawn)  (no BOM)
TP802  TP SMD  [TESTPOINT]  (value not drawn)  (no BOM)
TP803  TP SMD  [TESTPOINT]  (value not drawn)  (no BOM)
TP804  TP SMD  [TESTPOINT]  (value not drawn)  (no BOM)
TP805  TP SMD  [TESTPOINT]  (value not drawn)  (no BOM)
TP806  TP SMD  [TESTPOINT]  (value not drawn)  (no BOM)
TP807  TP SMD  [TESTPOINT]  (value not drawn)  (no BOM)
TP808  TP SMD  [TESTPOINT]  (value not drawn)  (no BOM)

### Ports
CAN0_RXD (bidir, see 5), CAN0_TXD (bidir, see 5), CAN1_RXD (bidir, see 5), CAN1_TXD (bidir, see 5), CANM_N (bidir, see 4), CANM_P (bidir, see 4), CLK_BISS (bidir, see 5), DATA_BISS (bidir, see 5), MOTOR_N (bidir, see 6), MOTOR_P (bidir, see 6)

### Nets
GND: C801.2 C802.2 C803.2 C804.2 C805.2 C806.2 D801.3(A) D802.3(A) D803.3(A) D804.3(A) IC801.2(GND) IC802.2(GND) IC803.4(GND) J803.5 J804.1 J804.2 J804.4 J804.5 R807.2 R814.2
VCC3V3: C805.1 IC803.1(VCC) J801.1 J802.1
VCC5V: F801.2 J801.3 J802.3 J804.3 J804.6 J804.7
BISS_MA_L_N: IC803.6(Z) R820.2
BISS_MA_L_P: IC803.5(Y) R822.2
BISS_MA_N: D804.1(K) J803.2 R820.1 R821.1 TP806.1
BISS_MA_P: D804.2(K) J803.1 R821.2 R822.1 TP805.1
BISS_SLO_L_N: IC803.7(B) R817.2
BISS_SLO_L_P: IC803.8(A) R815.2
BISS_SLO_N: D803.2(K) J803.6 R816.2 R817.1 TP807.1
BISS_SLO_P: D803.1(K) J803.7 R815.1 R816.1 TP808.1
CAN0_L_N: IC802.6(CANL) R813.2
CAN0_L_P: IC802.7(CANH) R808.2
CAN0_R_N: D802.1(K) LB802.2 R812.1 R813.1
CAN0_R_P: D802.2(K) LB802.1 R808.1 R809.2
CAN0_RXD: R811.2 ; port CAN0_RXD
CAN0_TXD: R810.2 ; port CAN0_TXD
CAN1_L_N: IC801.6(CANL) R806.2
CAN1_L_P: IC801.7(CANH) R801.2
CAN1_R_N: D801.1(K) LB801.2 R805.1 R806.1
CAN1_R_P: D801.2(K) LB801.1 R801.1 R802.2
CAN1_RXD: R804.2 ; port CAN1_RXD
CAN1_TXD: R803.2 ; port CAN1_TXD
CANM_N: LB801.3 TP802.1 ; port CANM_N
CANM_P: LB801.4 TP801.1 ; port CANM_P
CANS_N: J804.8 LB802.3 TP804.1
CANS_P: J804.9 LB802.4 TP803.1
CLK_BISS: R819.2 ; port CLK_BISS
DATA_BISS: R818.2 ; port DATA_BISS
MOTOR_N: J803.3 ; port MOTOR_N
MOTOR_P: J803.8 ; port MOTOR_P
NetC801_1: C801.1 IC801.3(VCC) J801.2
NetC802_1: C802.1 R802.1 R805.2
NetC803_1: C803.1 IC802.3(VCC) J802.2
NetC804_1: C804.1 R809.1 R812.2
NetC806_1: C806.1 F801.1 J803.9
NetIC801_1: IC801.1(TXD) R803.1
NetIC801_4: IC801.4(RXD) R804.1
NetIC801_8: IC801.8(STB) R807.1
NetIC802_1: IC802.1(TXD) R810.1
NetIC802_4: IC802.4(RXD) R811.1
NetIC802_8: IC802.8(STB) R814.1
NetIC803_2: IC803.2(R) R818.1
NetIC803_3: IC803.3(D) R819.1

Not connected (* = marked no-connect by the designer): IC801 5(SHDN)*; IC802 5(SHDN)*; J803 4

### Layout directives
differential pair: BISS_MA_L_N, BISS_MA_L_P, BISS_MA_N, BISS_MA_P, BISS_SLO_L_N, BISS_SLO_L_P, BISS_SLO_N, BISS_SLO_P, CAN0_L_N, CAN0_L_P, CAN0_R_N, CAN0_R_P, CAN1_L_N, CAN1_L_P, CAN1_R_N, CAN1_R_P, CANM_N, CANM_P, CANS_N, CANS_P

### Notes on the sheet
- (near J801) DUAL POWER
- DAMPER NOISE/RIPPLE
- SURGE PROTECTION
- (near R803) DAMPER NOISE/RIPPLE
- COMMON MODE REJECT NOISE
- (near R807) SLEW RATE CONTROL
- (near R810) DAMPER NOISE/RIPPLE
- (near R814) SLEW RATE CONTROL
- SPEED OF SENSOR 2M MAX
- (near R818) SPI HARDWARE COMPATIBLE INTERFACE
- DC MOTOR
- (near J803) ENCODER AND HALLS
- (near J804) CONNECT TO IMU BOARD
- COMBINE ENCODER & MOTOR
- TWIST PAIR  P&N WIRE

### Library data of the parts
C801 C803 = Cap: as C502 on sheet [5]_MOT_MCU MKV58; CATEGORY: CAP-CER; VALUE: 0.1uF; FOOTPRINT: 0603; Material: X7R; Voltage: 50V; Tolerance: ±10%; MANUFACTURER2: UWA
C802 C804 = Cap: CAP-CER,SMD; 47nF,10%,50V,X7R,0603; MANUFACTURER1: Meritek; MANUFACTURER1_PART#: MA0603XR473K500; MANUFACTURER2_PART#: C0603X7R500-473KNE; Unit: PCS; PACKING: Tape & Reel (TR); PCB FOOTPRINT: 0603; Process Type: SM; CATEGORY: CAP-CER; VALUE: 47nF; FOOTPRINT: 0603; Material: X7R; Voltage: 50V; Tolerance: ±10%; MANUFACTURER2: Venkel
C805 C806 = Cap: as C401 on sheet [4]_MOT_POWER; CATEGORY: CAP-CER; VALUE: 0.1uF; Material: X7R; Voltage: 50V; PCB FOOTPRINT: 0603; Tolerance: ±10%; MANUFACTURER2: UWA
D801 D802 = TVS_DUAL_SIGNAL_5V_SOT23: TVS DIODE 24VWM 50VC SOT23-; MANUFACTURER1: Littelfuse; CURRENT: 10A; POWER: 230W; Category: TVS; MANUFACTURER1_PART#: RESD1CANYT116; Value: RESD1CANYT116; LOH_CODE: *; LINK: https://www.digikey.com/en/products/detail/littelfuse-inc/SM24CANB-02HTG/5048174?s=N4IgTCBcDaIMoFkwBYDCBBAcgIQLQAYwAJAFQHEQBdAXyA; PRICE: 0.78000
D803 D804 = TVS_DUAL_SIGNAL_5V_SOT23: 5V, ESD PROTECTION DEVICES, SOT-23; MANUFACTURER2_PART#: DF3D6.8MS,LF; MANUFACTURER1: ON Semiconductor; CURRENT: 1A; POWER: 320W; Category: TVS; MANUFACTURER1_PART#: ESDR0502BT1G; MANUFACTURER2: Toshiba; Value: ESDR0502BT1G; LOH_CODE: *
F801 = 0875.800MXEP: PTC RESET FUSE 48V 160MA 1206; MANUFACTURER1_PART#: 0ZCJ0016FF2E; MANUFACTURER2_PART#: CLA1684; MANUFACTURER1: Bel Fuse; PROCESS_TYPE: SM; Unit: PCS; Response Time: 8ms; Breaking Capacity @ Rated Voltage: 10A; DC Cold Resistance: 1.1 Ohms; CATEGORY: FUSE; MANUFACTURER2: https://linhkienchatluong.vn/cau-chi-tu-phuc-hoi-ptc/cau-chi-tu-phuc-hoi-1206-01a-60v-ptc-smd_sp845_ct4084.aspx; Value: 0ZCG0014FF2C
IC801 IC802 = IC;IC CAN TRANSEIVER HS,8SOIC,-40TO150°C,TJA1042T/3,118: IC CAN TXRX 3.3V 2MBPS SOIC; MANUFACTURER1: Maxim; Manufacturer Part Number: MAX33041EASA+; VALUE: MAX33041EASA+; Category: IC; MANUFACTURER1_PART#: MAX33041EASA+; LINK: https://www.digikey.com/en/products/detail/maxim-integrated/MAX33041EASA/15286828; PRICE: 3.5700
IC803 = IC;IC TRANSCEIVER FULL 1/1 8SOIC,8-SOIC,-40TO 85°C,SN65HVD77DR: IC TRANSCEIVER FULL 1/1 8VSSOP; Manufacturer: TI; MANUFACTURER1: Texas Instruments; VALUE: SN65HVD77DGK; Category: IC; LINK: https://www.digikey.com/en/products/detail/texas-instruments/SN65HVD77DR/4965743; PRICE: 3.623; MANUFACTURER1_PART#: SN65HVD77DGK
J801 J802 = JP 2-1: Jumper 2-1; Value: J2-1
J803 J804 = CONN-DIP;CONN MICRO-D PLUG 9POS R/A SLDR,M,MDM-9PCBRP: CONN MICRO-D PLUG 9POS R/A SLDR; Manufacturer: ITT CANNON, LLC; Manufacturer Part Number: MDM-9PCBRP; MANUFACTURER1: ITT CANNON, LLC; MANUFACTURER1_PART#: MDM-9PCBRP
  J803: Category: CONN
  J804: CATEGORY: CONN
LB801 LB802 = CHOKE-SMD;90OHM@100MHz,0.15A,5V,DLP11SA900HL2L: CMC 1A 2LN 2.7KOHM SMD; MANUFACTURER1: Mag Layers; VALUE: MCM-7060M-272-RU; LINK: https://www.digikey.com/en/products/detail/mag-layers/MCM-7060M-272-RU/13910475; MANUFACTURER1_PART#: MCM-7060M-272-RU; NI_MARK: *; MANUFACTURER2_PART#: *; MANUFACTURER2: *; Category: CHOKE; PRICE: 0.60000; PACKAGE: (7.50mm x 6.00mm)
R801 R806 R808 R813 R817 R820 R822 = Res0.3: RES SMD 2.2 OHM 5% 1/10W 0603; MANUFACTURER1: Yageo; MANUFACTURER1_PART#: RC0603JR-072R2L; MANUFACTURER2_PART#: RMCF0603JT2R20; PACKING: Tape & Reel (TR); PCB Footprint: 0603; Process Type: SM; Unit: PCS; Power: 0.25W; Value: 2.2R; CATEGORY: RES-SMD; MANUFACTURER2: Stackpole Electronics Inc; Tolerance: ±5%
R802 R805 R809 R812 = RES-SMD;60.4OHM,1%,0402,1/10W: RES SM 62 OHM 1% 1/10W 0603; MANUFACTURER1: Stackpole; MANUFACTURER1_PART#: RMCF0603FT62R0; MANUFACTURER2_PART#: RC0603FR-0762RL; VALUE: 62R; Category: RES-SMD; MANUFACTURER2: YAGEO
R803 R804 R810 R811 R818 R819 = Res0.3: as R508 on sheet [5]_MOT_MCU MKV58; Value: 1K; CATEGORY: RES SMD; MANUFACTURER2: UWA; Tolerance: ±5%
R807 R814 = Res0.3: RES 26.1K OHM 1% 1/10W 0603; MANUFACTURER1: Stackpole Electronics Inc; MANUFACTURER1_PART#: RMCF0603FT26K1; MANUFACTURER2_PART#: RC0603FR-0726K1L; PACKING: Tape & Reel (TR); Process Type: SM; Unit: PCS; Power: 0.25W; Value: 26.1K; CATEGORY: RES-SMD; MANUFACTURER2: YAGEO; Tolerance: ±1%
R815 = Res0.3: RES SMD 2.2 OHM 5% 1/10W 0603; MANUFACTURER1: Yageo; MANUFACTURER1_PART#: RC0603JR-072R2L; MANUFACTURER2_PART#: RMCF0603JT2R20; PACKING: Tape & Reel (TR); Process Type: SM; Unit: PCS; Power: 0.25W; Value: 2.2R; CATEGORY: RES-SMD; MANUFACTURER2: Stackpole Electronics Inc; Tolerance: ±5%
R816 R821 = RES 120 OHM 5% 1/10W 0603: MANUFACTURER1: Stackpole; MANUFACTURER1_PART#: RMCF0603JG120R; PROC: SM; Unit: PCS; CATEGORY: RES-SMD; VALUE: 120R; FOOTPRINT: 0603
TP801-TP808 = TP SMD: TEST POINT

## Sheet [9]_MOT_tMCU MKV58.SchDoc
size A3; DocumentNumber: 9; SheetNumber: 9; SheetTotal: 12; Ngu?i ki?m tra: bangdd; Ngu?i thi?t k?: thannt114
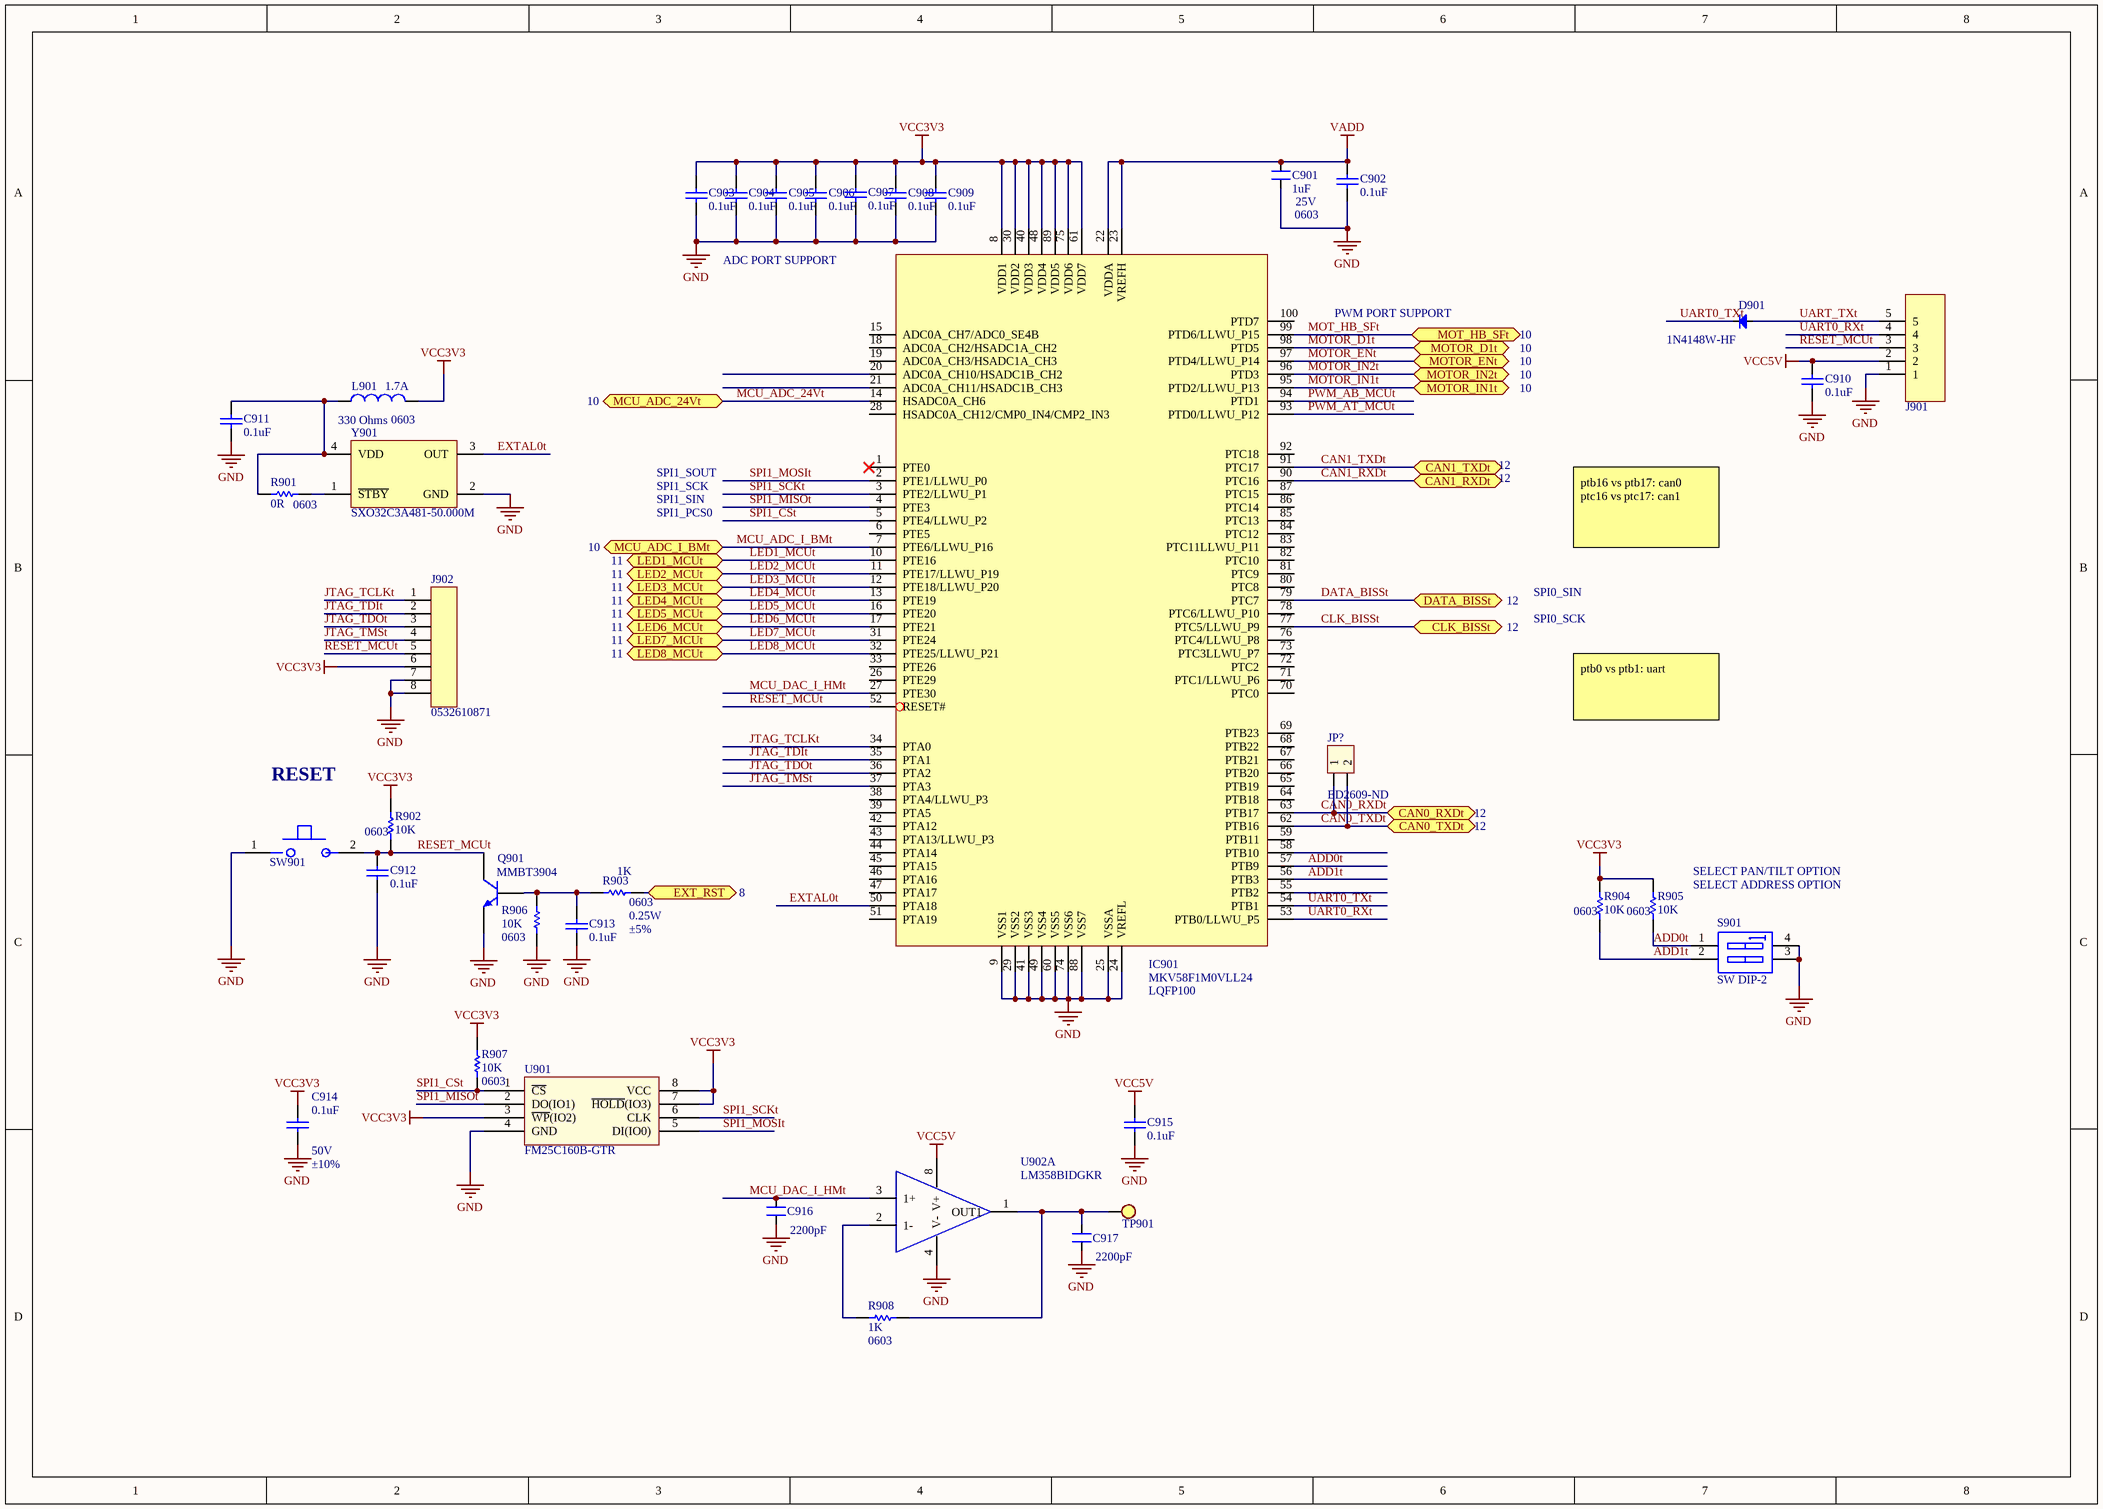
[diagram p5: [9]_MOT_tMCU MKV58.SchDoc]

### Parts
C901  PCB FOOTPRINT: 0603  Voltage: 25V  [CAP 0603]  (hidden comment: 1uF)
C902  0.1uF  [CAP 0603]
C903  0.1uF  [CAP 0603]
C904  0.1uF  [CAP 0603]
C905  0.1uF  [CAP 0603]
C906  0.1uF  [CAP 0603]
C907  0.1uF  [CAP 0603]
C908  0.1uF  [CAP 0603]
C909  0.1uF  [CAP 0603]
C910  0.1uF  [CAP 0603]
C911  0.1uF  [CAP 0603]
C912  0.1uF  [CAP 0603]
C913  0.1uF  [CAP 0603]
C914  Voltage: 50V  Tolerance: ±10%  [CAP 0603]  (hidden comment: 0.1uF)
C915  0.1uF  [CAP 0603]
C916  2200pF  [CAP 0603]
C917  2200pF  [CAP 0603]
D901  1N4148W-HF  [DIO-SMD-123]
IC901  MANUFACTURER1_PART#: MKV58F1M0VLL24  PACKAGE: LQFP100  [100-LQFP]  (hidden comment: IC;IC MCU 32BIT 1MB FLASH 100LQFP,100-LQFP,-40TO 105°C,MKV58F1M0VLL24)
J901  HEADER;HEADER 5 POS 2.54MM  [HEADER 5 2.54MM]  (value not drawn)
J902  Manufacturer Part Number: 0532610871  [CONN-8]  (hidden comment: CONN-SMD;CONN HEADER SMD R/A,M,1Rx8Px1.25MM,0532610871)
JP?  ED2609-ND  [MF52A2103J3470]
L901  PCB Footprint: 0603  Current: 1.7A  [FB 0603]  (hidden comment: 330 Ohms)
Q901  MMBT3904  [SOT-23]
R901  PCB Footprint: 0603  [res 0603]  (hidden comment: 0R)  (no BOM)
R902  PCB Footprint: 0603  [res 0603]  (hidden comment: 10K)
R903  PCB Footprint: 0603  Power: 0.25W  Tolerance: ±5%  [res 0603]  (hidden comment: 1K)
R904  PCB Footprint: 0603  [res 0603]  (hidden comment: 10K)
R905  PCB Footprint: 0603  [res 0603]  (hidden comment: 10K)
R906  PCB Footprint: 0603  [res 0603]  (hidden comment: 10K)
R907  PCB Footprint: 0603  [res 0603]  (hidden comment: 10K)
R908  PCB Footprint: 0603  [res 0603]  (hidden comment: 1K)
S901  SW DIP-2  [219-2LPSTR]
SW901  SWITCH;TACTILE SWITCH SPST-NO TOP ACTUATED,2-SMD,MJTP1106STR  [SW]  (value not drawn)
TP901  TP SMD  [TESTPOINT]  (value not drawn)  (no BOM)
U901  FM25C160B-GTR  [SOIC-8 150MIL]
U902  LM358BIDGKR  [8-VSSOP]  (part A of 2)
Y901  SXO32C3A481-50.000M  [DFN210P320X85-4N]

### Ports
CAN0_RXDt (bidir, see 12), CAN0_TXDt (bidir, see 12), CAN1_RXDt (bidir, see 12), CAN1_TXDt (bidir, see 12), CLK_BISSt (bidir, see 12), DATA_BISSt (bidir, see 12), EXT_RST (bidir, see 8), LED1_MCUt (bidir, see 11), LED2_MCUt (bidir, see 11), LED3_MCUt (bidir, see 11), LED4_MCUt (bidir, see 11), LED5_MCUt (bidir, see 11), LED6_MCUt (bidir, see 11), LED7_MCUt (bidir, see 11), LED8_MCUt (bidir, see 11), MCU_ADC_24Vt (bidir, see 10), MCU_ADC_I_BMt (bidir, see 10), MOT_HB_SFt (bidir, see 10), MOTOR_D1t (bidir, see 10), MOTOR_ENt (bidir, see 10), MOTOR_IN1t (bidir, see 10), MOTOR_IN2t (bidir, see 10)

### Nets
GND: C901.2 C902.2 C903.2 C904.2 C905.2 C906.2 C907.2 C908.2 C909.2 C910.2 C911.2 C912.2 C913.2 C914.2 C915.1 C916.2 C917.2 IC901.9(VSS1) IC901.24(VREFL) IC901.25(VSSA) IC901.29(VSS2) IC901.41(VSS3) IC901.49(VSS4) IC901.60(VSS5) IC901.74(VSS6) IC901.88(VSS7) J901.1 J902.7 J902.8 Q901.2(E) R906.2 S901.3(B2) S901.4(B1) SW901.1 U901.4(GND) U902.4(V-) Y901.2(GND)
VADD: C901.1 C902.1 IC901.22(VDDA) IC901.23(VREFH)
VCC3V3: C903.1 C904.1 C905.1 C906.1 C907.1 C908.1 C909.1 C914.1 IC901.8(VDD1) IC901.30(VDD2) IC901.40(VDD3) IC901.48(VDD4) IC901.61(VDD7) IC901.75(VDD6) IC901.89(VDD5) J902.6 L901.2 R902.1 R904.1 R905.1 R907.1 U901.3(~{WP}(IO2)) U901.7(~{HOLD}(IO3)) U901.8(VCC)
VCC5V: C910.1 C915.2 J901.2 U902.8(V+)
ADD0t: IC901.57(PTB9) R905.2 S901.1(A1)
ADD1t: IC901.56(PTB3) R904.2 S901.2(A2)
CAN0_RXDt: IC901.63(PTB17) JP?.1 ; port CAN0_RXDt
CAN0_TXDt: IC901.62(PTB16) JP?.2 ; port CAN0_TXDt
CAN1_RXDt: IC901.90(PTC16) ; port CAN1_RXDt
CAN1_TXDt: IC901.91(PTC17) ; port CAN1_TXDt
CLK_BISSt: IC901.77(PTC5/LLWU_P9) ; port CLK_BISSt
DATA_BISSt: IC901.79(PTC7) ; port DATA_BISSt
EXTAL0t: IC901.50(PTA18) Y901.3(OUT)
JTAG_TCLKt: IC901.34(PTA0) J902.1
JTAG_TDIt: IC901.35(PTA1) J902.2
JTAG_TDOt: IC901.36(PTA2) J902.3
JTAG_TMSt: IC901.37(PTA3) J902.4
LED1_MCUt: IC901.10(PTE16) ; port LED1_MCUt
LED2_MCUt: IC901.11(PTE17/LLWU_P19) ; port LED2_MCUt
LED3_MCUt: IC901.12(PTE18/LLWU_P20) ; port LED3_MCUt
LED4_MCUt: IC901.13(PTE19) ; port LED4_MCUt
LED5_MCUt: IC901.16(PTE20) ; port LED5_MCUt
LED6_MCUt: IC901.17(PTE21) ; port LED6_MCUt
LED7_MCUt: IC901.31(PTE24) ; port LED7_MCUt
LED8_MCUt: IC901.32(PTE25/LLWU_P21) ; port LED8_MCUt
MCU_ADC_24Vt: IC901.14(HSADC0A_CH6) ; port MCU_ADC_24Vt
MCU_ADC_I_BMt: IC901.7(PTE6/LLWU_P16) ; port MCU_ADC_I_BMt
MCU_DAC_I_HMt: C916.1 IC901.27(PTE30) U902.3(1+)
MOT_HB_SFt: IC901.99(PTD6/LLWU_P15) ; port MOT_HB_SFt
MOTOR_D1t: IC901.98(PTD5) ; port MOTOR_D1t
MOTOR_ENt: IC901.97(PTD4/LLWU_P14) ; port MOTOR_ENt
MOTOR_IN1t: IC901.95(PTD2/LLWU_P13) ; port MOTOR_IN1t
MOTOR_IN2t: IC901.96(PTD3) ; port MOTOR_IN2t
PWM_AB_MCUt: IC901.94(PTD1)
PWM_AT_MCUt: IC901.93(PTD0/LLWU_P12)
RESET_MCUt: C912.1 IC901.52(RESET#) J901.3 J902.5 Q901.3(C) R902.2 SW901.2
SPI1_CSt: IC901.5(PTE4/LLWU_P2) R907.2 U901.1(~{CS})
SPI1_MISOt: IC901.4(PTE3) U901.2(DO(IO1))
SPI1_MOSIt: IC901.2(PTE1/LLWU_P0) U901.5(DI(IO0))
SPI1_SCKt: IC901.3(PTE2/LLWU_P1) U901.6(CLK)
UART0_RXt: IC901.53(PTB0/LLWU_P5) J901.4
UART0_TXt: D901.2(K) IC901.54(PTB1)
UART_TXt: D901.1(A) J901.5
NetC911_1: C911.1 L901.1 R901.1 Y901.4(VDD)
NetC913_1: C913.1 Q901.1(B) R903.2 R906.1
NetC917_1: C917.1 R908.2 TP901.1 U902.1(OUT1)
NetR401_1: R903.1 ; port EXT_RST
NetR901_2: R901.2 Y901.1(~{STBY})
NetR908_1: R908.1 U902.2(1-)

Not connected (* = marked no-connect by the designer): IC901 1(PTE0)* 6(PTE5) 15(ADC0A_CH7/ADC0_SE4B) 18(ADC0A_CH2/HSADC1A_CH2) 19(ADC0A_CH3/HSADC1A_CH3) 20(ADC0A_CH10/HSADC1B_CH2) 21(ADC0A_CH11/HSADC1B_CH3) 26(PTE29) 28(HSADC0A_CH12/CMP0_IN4/CMP2_IN3) 33(PTE26) 38(PTA4/LLWU_P3) 39(PTA5) 42(PTA12) 43(PTA13/LLWU_P3) 44(PTA14) 45(PTA15) 46(PTA16) 47(PTA17) 51(PTA19) 55(PTB2) 58(PTB10) 59(PTB11) 64(PTB18) 65(PTB19) 66(PTB20) 67(PTB21) 68(PTB22) 69(PTB23) 70(PTC0) 71(PTC1/LLWU_P6) 72(PTC2) 73(PTC3LLWU_P7) 76(PTC4/LLWU_P8) 78(PTC6/LLWU_P10) 80(PTC8) 81(PTC9) 82(PTC10) 83(PTC11LLWU_P11) 84(PTC12) 85(PTC13) 86(PTC14) 87(PTC15) 92(PTC18) 100(PTD7)

### Notes on the sheet
- ADC PORT SUPPORT
- PWM PORT SUPPORT
- SPI1_SOUT
- SPI1_SCK
- SPI1_SIN
- SPI1_PCS0
- ptb16 vs ptb17: can0
  ptc16 vs ptc17: can1
- SPI0_SIN
- SPI0_SCK
- ptb0 vs ptb1: uart
- RESET
- SELECT PAN/TILT OPTION
- SELECT ADDRESS OPTION

### Library data of the parts
C901 = Cap_1uF: as C402 on sheet [4]_MOT_POWER; Value: 1uF; CATEGORY: CAP CER; PCB_ Footprint: 0603; MANUFACTURER2: Taiyo Yuden; LOH_Code: *
C902-C913 C915 = Cap: as C502 on sheet [5]_MOT_MCU MKV58; CATEGORY: CAP-CER; VALUE: 0.1uF; FOOTPRINT: 0603; Material: X7R; Voltage: 50V; Tolerance: ±10%; MANUFACTURER2: UWA
C914 = Cap: as C515 on sheet [5]_MOT_MCU MKV58; CATEGORY: CAP-CER; VALUE: 0.1uF; FOOTPRINT: 0603; Material: X7R; MANUFACTURER2: UWA
C916 C917 = CN: as C516 on sheet [5]_MOT_MCU MKV58; Value: 2200pF; CATEGORY: CAP CER; Voltage - Rated: 50V; Temperature Coefficient: X7R
D901 = Diode SMD: as D501 on sheet [5]_MOT_MCU MKV58; MANUFACTURER1_PART#: 1N4148W-HF; Value: 1N4148W-HF
IC901 = IC;IC MCU 32BIT 1MB FLASH 100LQFP,100-LQFP,-40TO 105°C,MKV58F1M0VLL24: as IC501 on sheet [5]_MOT_MCU MKV58; Manufacturer Part Number: MKV58F1M0VLL24; Category: IC; MANUFACTURER1: NXP USA Inc.
J901 = HEADER;HEADER 5 POS 2.54MM: as J501 on sheet [5]_MOT_MCU MKV58
J902 = CONN-SMD;CONN HEADER SMD R/A,M,1Rx8Px1.25MM,0532610871: as J502 on sheet [5]_MOT_MCU MKV58; Category: CONN; MANUFACTURER1_PART#: 0532610871
JP? = Con2: as JP501 on sheet [5]_MOT_MCU MKV58; Digikey: ED2609-ND
L901 = inductor 2.2uF: as L401 on sheet [4]_MOT_POWER; Category: Inductor; DESCRIPTION_: FERRITE BEAD 330 OHM 0603 1LN; MANUFACTURER2: Murata Electronics; Value: 330 Ohms
Q901 = NPN: as Q501 on sheet [5]_MOT_MCU MKV58; PACKAGE: SOT23; Category: TRANSISTOR; MANUFACTURER2: HT(Shenzhen Jinyu Semicon); MANUFACTURER2_PART#: MMBT3904; MANUFACTURER1_PART#: MMBT3904; Value: MMBT3904
R901 = Res0.3: as R401 on sheet [4]_MOT_POWER; Value: 0R; CATEGORY: RES SMD; MANUFACTURER2: Stackpole Electronics Inc
R902 R904-R907 = Res0.3: as R403 on sheet [4]_MOT_POWER; Value: 10K; CATEGORY: RES-SMD; MANUFACTURER2: UWA; Tolerance: ±5%
R903 = Res0.3: as R503 on sheet [5]_MOT_MCU MKV58; Value: 1K; CATEGORY: RES SMD; MANUFACTURER2: UWA
R908 = Res0.3: as R508 on sheet [5]_MOT_MCU MKV58; Value: 1K; CATEGORY: RES SMD; MANUFACTURER2: UWA; Tolerance: ±5%
S901 = SW DIP-2: as S501 on sheet [5]_MOT_MCU MKV58; PRICE: 0.48800; CATEGORY: SWITCH; LINK: https://www.digikey.com/en/products/detail/cui-devices/DS04-254-2-02BK-SMT/11310860
SW901 = SWITCH;TACTILE SWITCH SPST-NO TOP ACTUATED,2-SMD,MJTP1106STR: as SW501 on sheet [5]_MOT_MCU MKV58; Manufacturer Part Number: MJTP1106STR; Category: BUTTON; MANUFACTURER1_PART#: MJTP1106STR
TP901 = TP SMD: TEST POINT
U901 = IC Flash W25Q16JVSNIQ QUAD SO8: as U501 on sheet [5]_MOT_MCU MKV58; Category: IC; MANUFACTURER1_PART#: FM25C160B-GTR; Value: FM25C160B-GTR
U902 = LM358BIDGKR: IC OPAMP GP 2 CIRCUIT 8VSSOP; Manufacturer Part Number: LM358BIDGKR
Y901 = OSCILLATOR;50MHZ,50ppm,3.2x2.5mm,ASEMB-50.000MHZ-LC-T: as Y501 on sheet [5]_MOT_MCU MKV58; Manufacturer Part Number: SXO32C3A481-50.000M; MANUFACTURER1_PART#: SXO32C3A481-50.000M; VALUE: SXO32C3A481-50.000M